# EasyEDA Pro project RCkid.epro, board RCKid
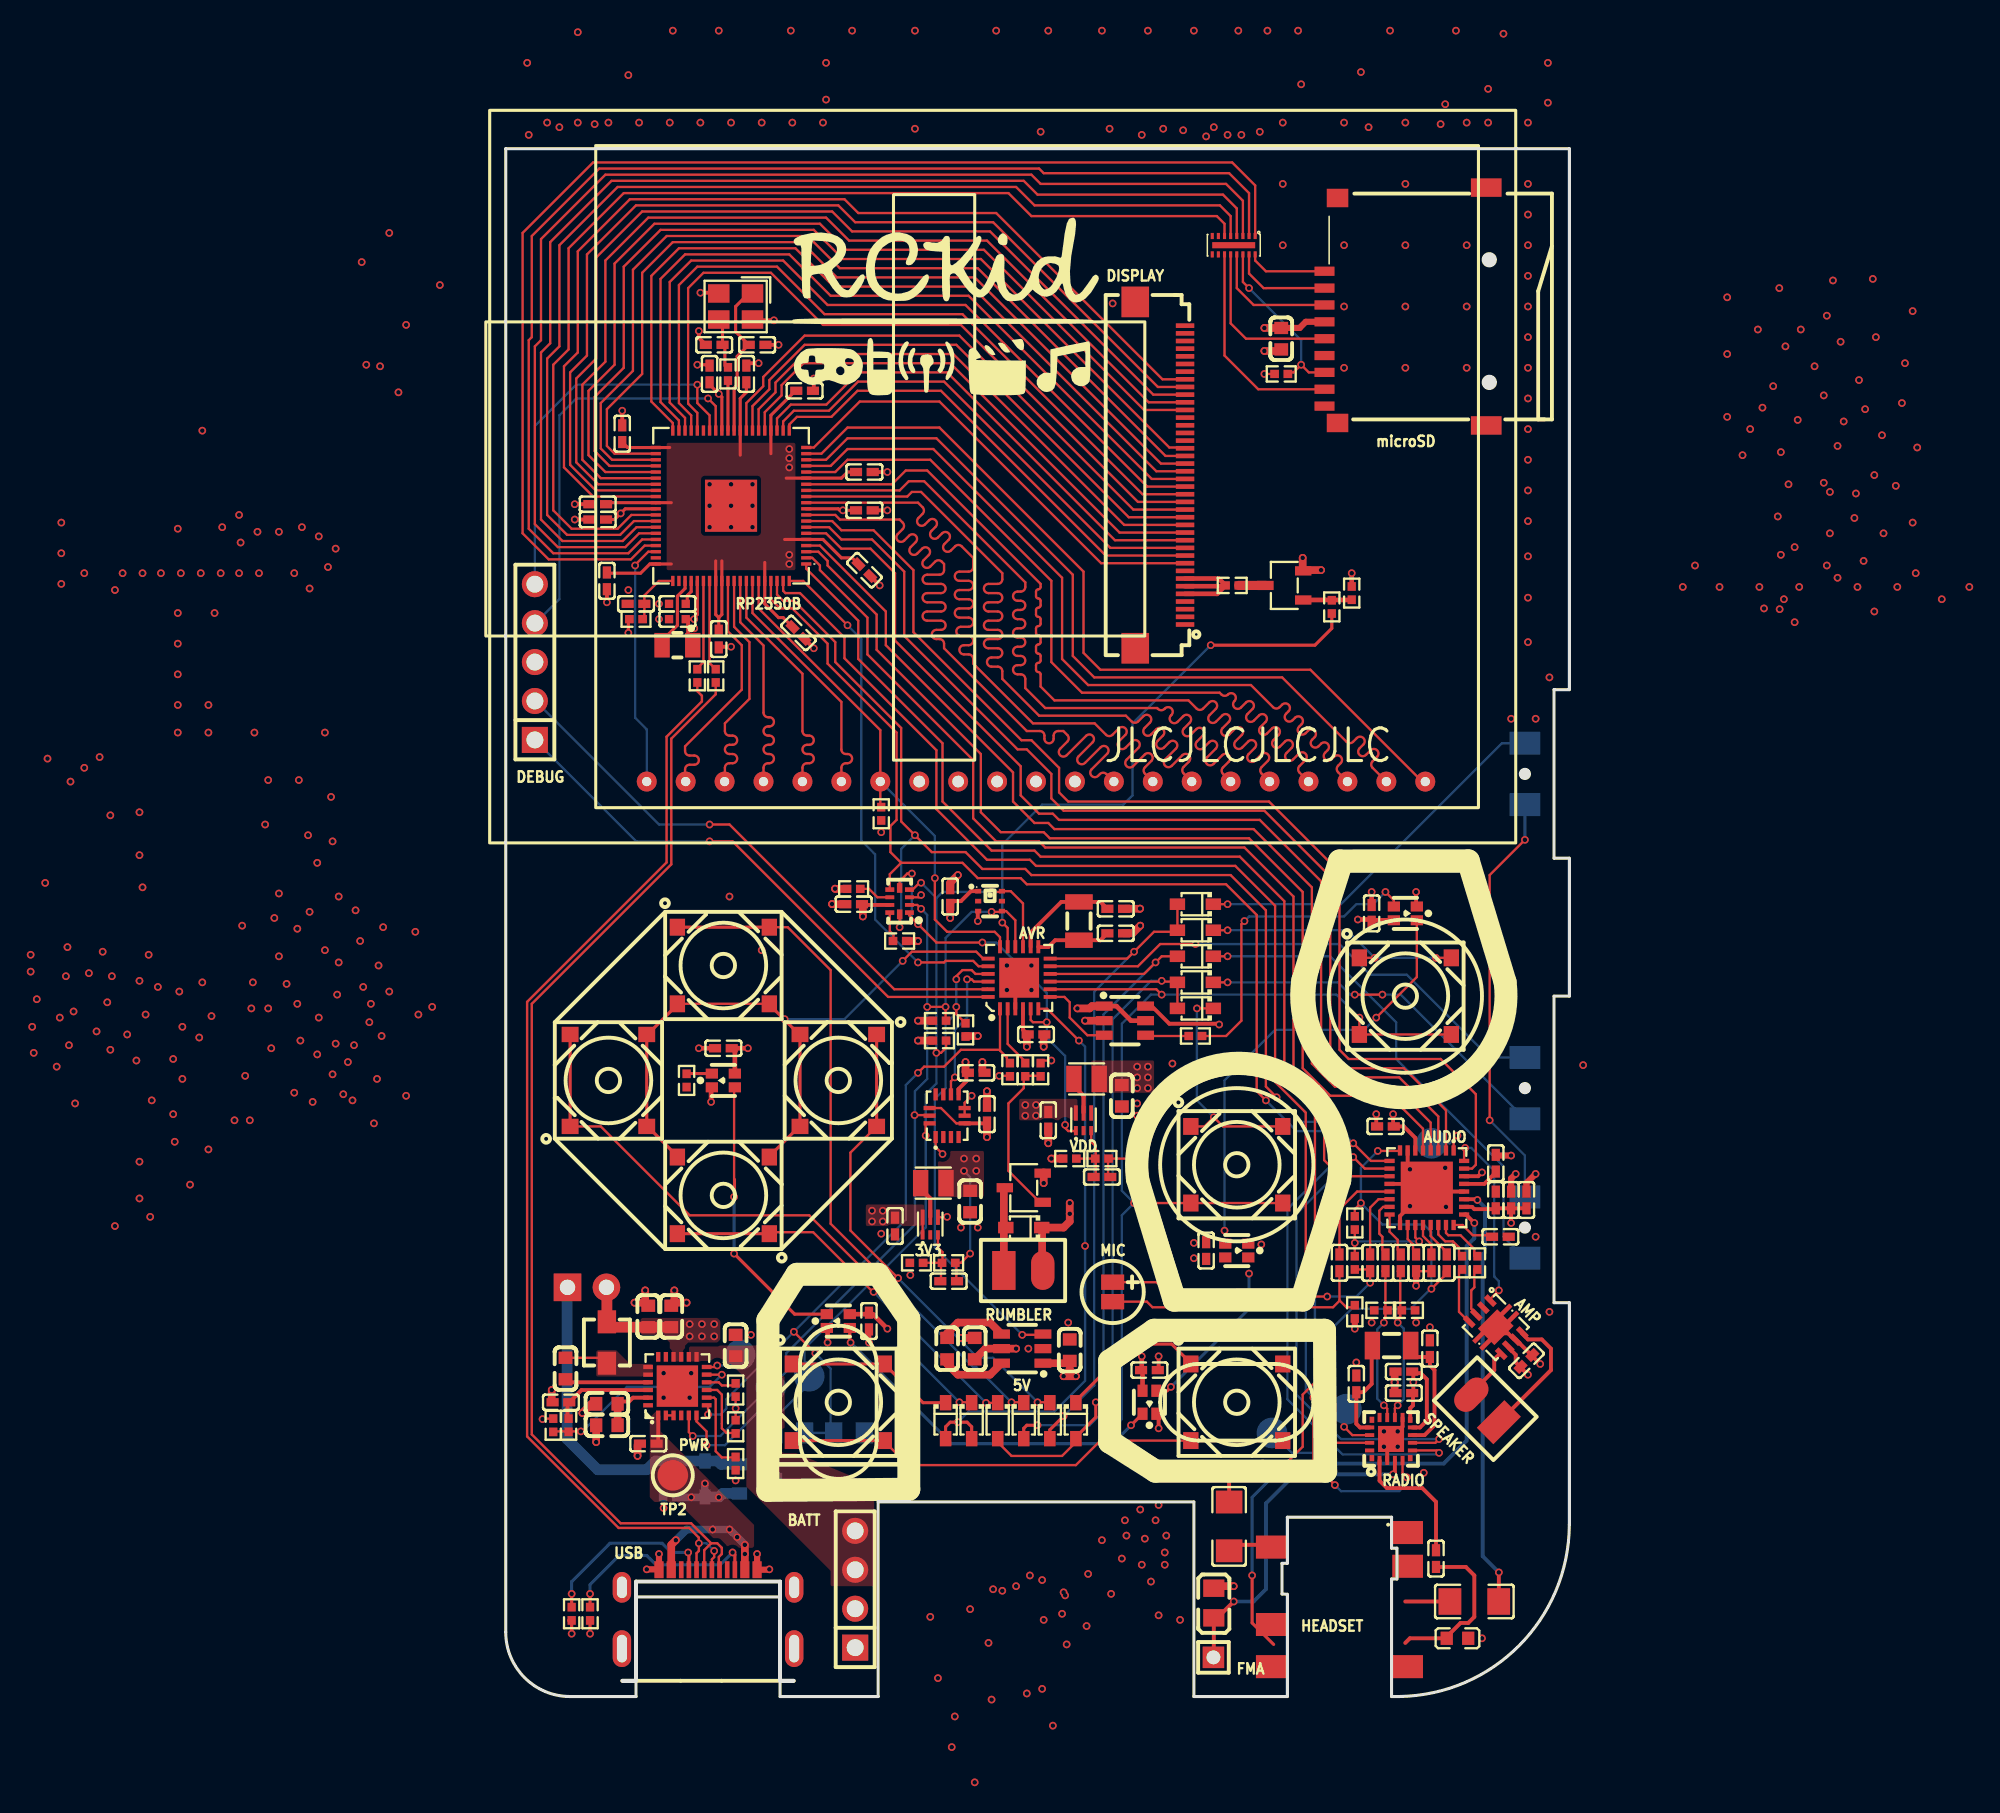
[diagram p26: board, top side]
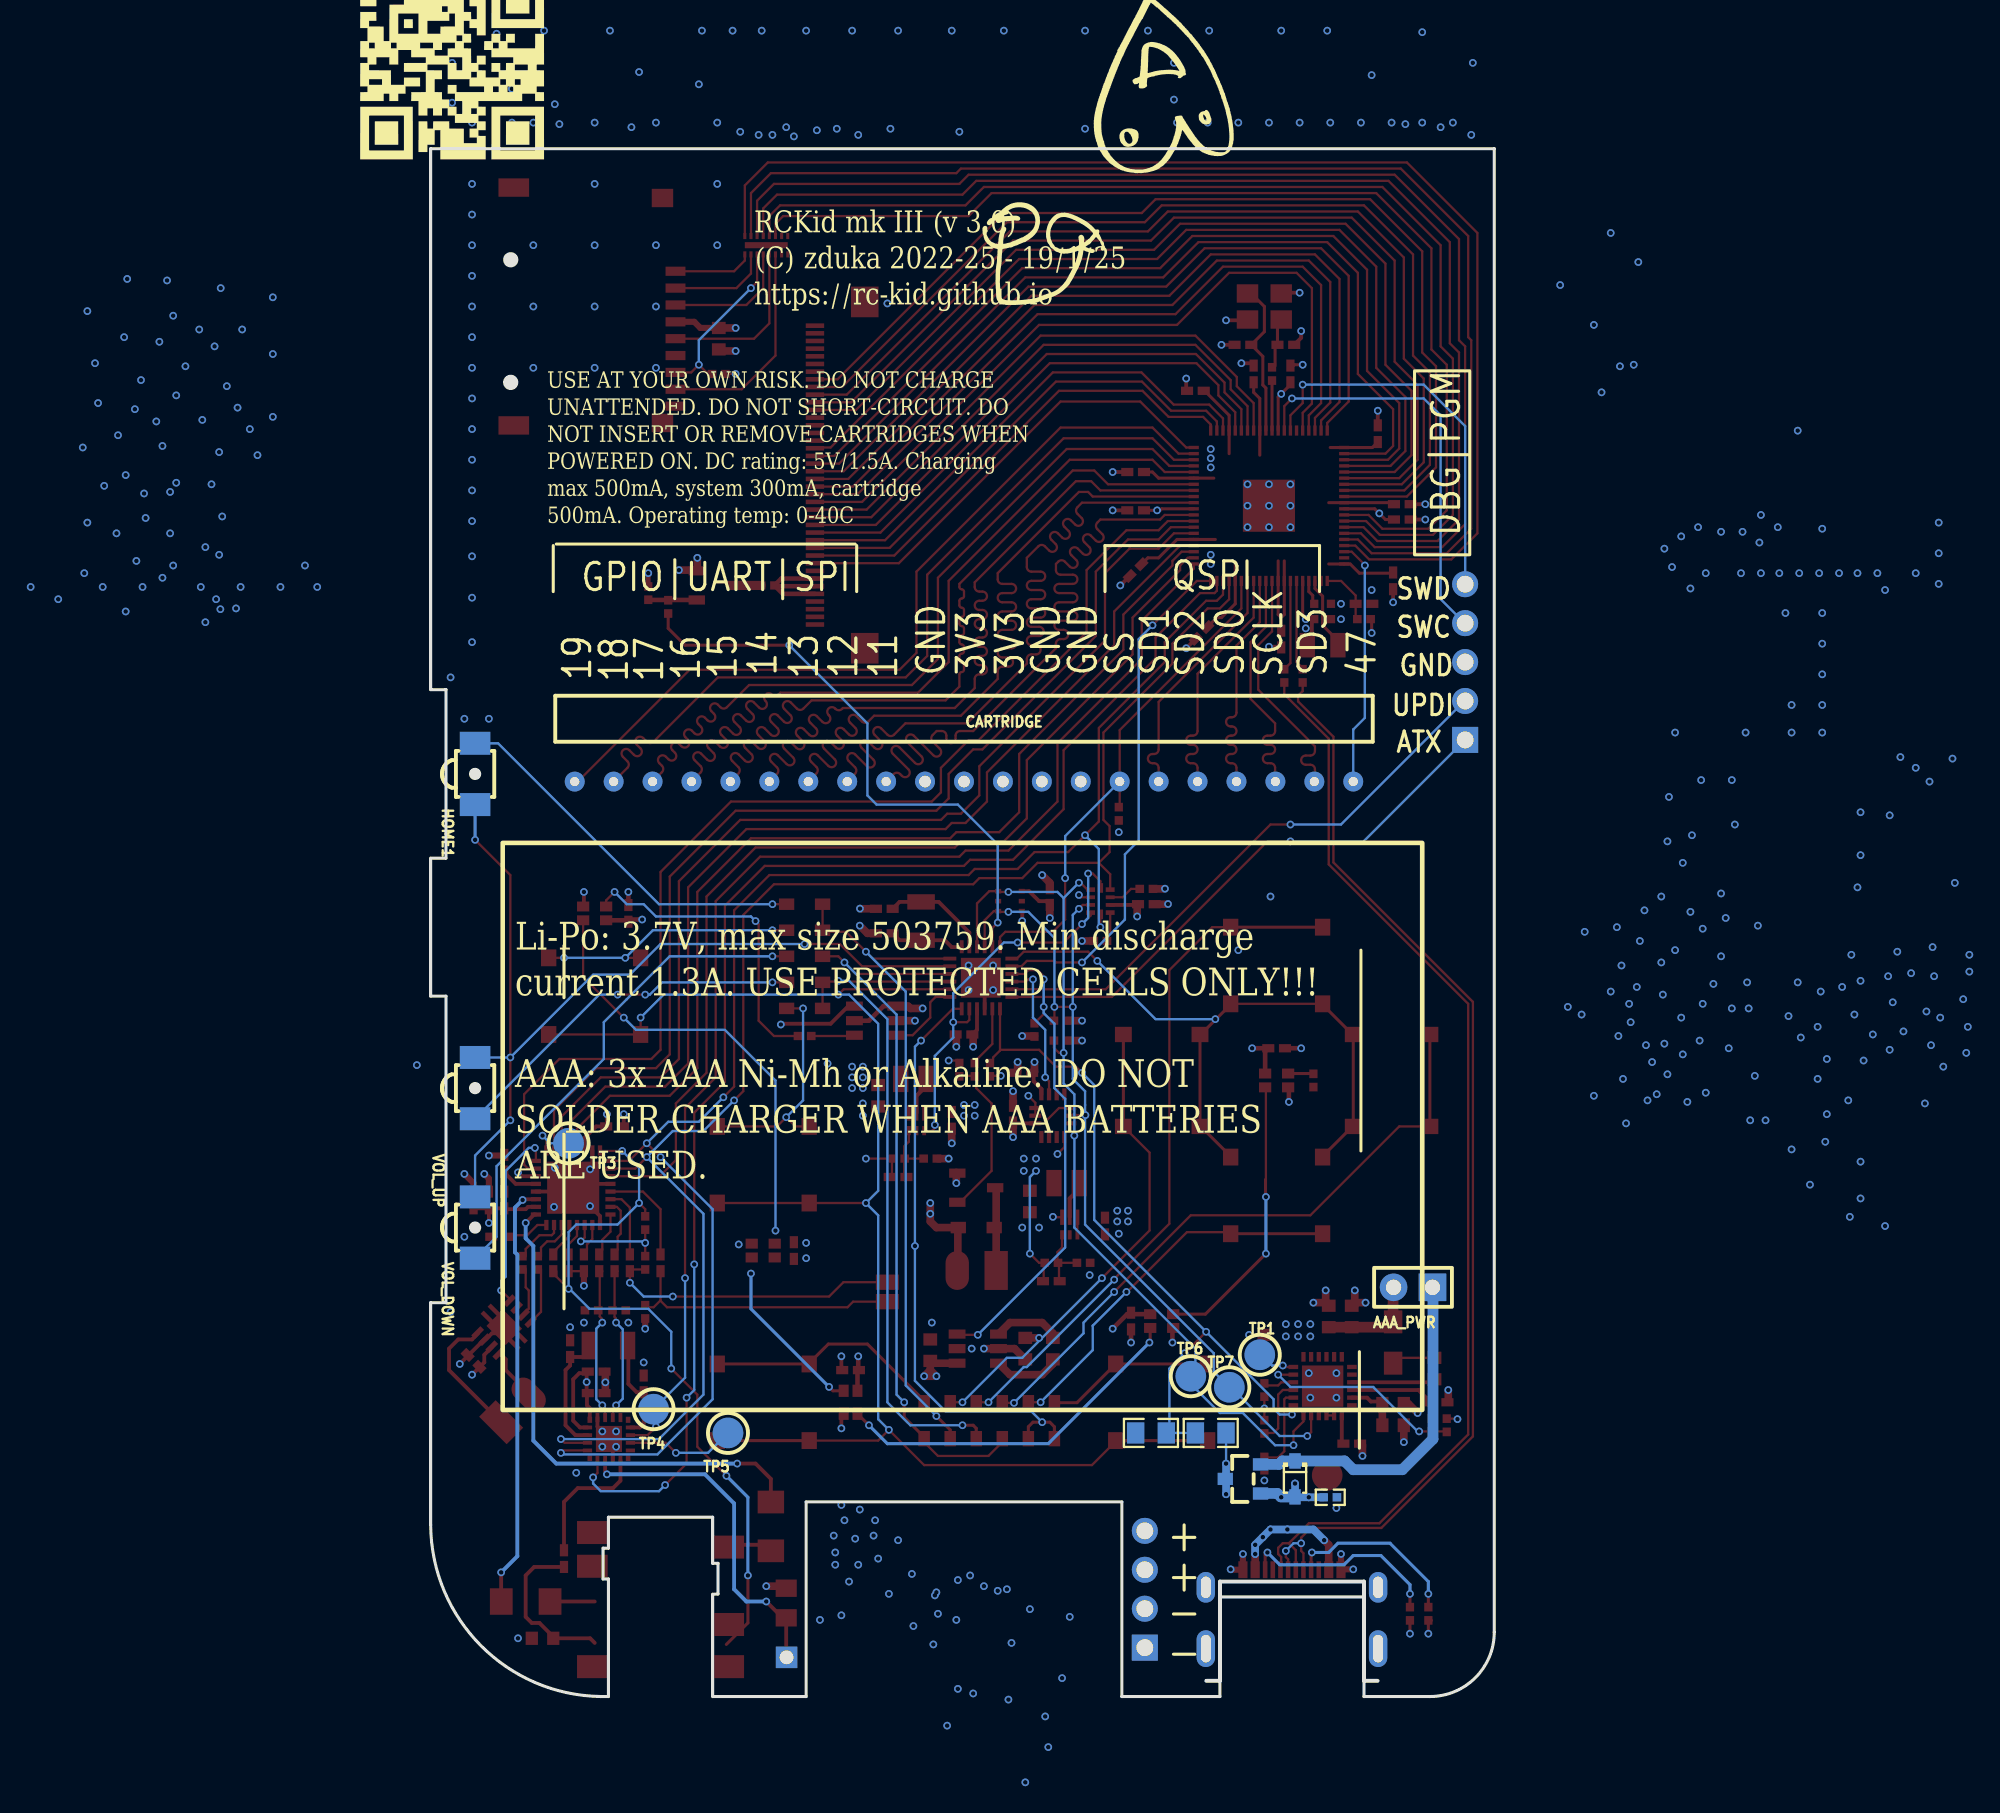
[diagram p27: board, bottom side, seen from below]

Outline 69.4 x 101 mm; copper layers: Top Layer, Inner1, Inner2, Bottom Layer. Coordinates in mm from the lower left corner of the outline.
Outline path: 0,101 69.4,101 69.4,65.7 68.4,65.7 68.4,54.7 69.4,54.7 69.4,45.7 68.4,45.7 68.4,25.7 69.4,25.7 69.4,11.2 arc(66.14,3.34) 58.3,0 57.8,0 57.8,7.67 58.15,7.67 58.15,9.68 57.8,9.68 57.8,11.7 51,11.7 51,8.69 50.65,8.69 50.65,6.69 51,6.67 51,0 44.9,0 44.9,12.7 24.3,12.7 24.3,0 17.9,0 17.9,6.5 8.5,6.5 8.5,0 4.2,0 arc(1.23,1.23) 0,4.2 0,101
Stack: Top Layer 0.035mm / Dielectric1 0.28mm PP er 4.5 / Inner1 0.035mm / Dielectric2 0.28mm FR4 er 4.5 / Inner2 0.035mm / Dielectric3 0.28mm PP er 4.5 / Bottom Layer 0.035mm

## Design rules (mm)
net USB_DM: DP1
net USB_DP: DP1
template: Custom Config
spacing copperThickness1oz (default): track to track 0.45, other pairs 0.127 to 0.3
spacing copperThickness2oz: track to track 0.203, other pairs 0.152 to 0.3
track width copperThickness1oz (default): min 0.127, default 0.254, max 2.54
track width copperThickness2oz: min 0.203, default 0.254, max 2.54
differential pair differentialPair (default): width min 0.127, default 0.254, max 2.54; gap min 0.152, default 0.152
via viaSize (default): diameter min 0.5, default 0.61, max 10; hole min 0.3, default 0.305, max 6.3
net 3V3 uses copperRegion1
net VUSB uses copperRegion1
net 5V uses copperRegion1
net VCC uses copperRegion1
net $1N63472 uses copperRegion1
net VBATT uses copperRegion1
pour e832 uses copperRegion1

## Placement (name value [footprint] x y rotation side)
3V3  TPS62825DMQT  [VSON-6_L1.5-W1.5-P0.50-TL]  27.7 30.7 90 top
5V  HX4002-MFC  [SOT-23-6_L2.9-W1.6-P0.95-LS2.8-BR]  33.7 22.7 0 top
A1  SKRRACE010  [KEY-SMD_4P-L7.5-W7.0-P5.00-TL]  47.7 34.7 0 top
AAA_PWR  -  [HDR-TH_2P-P2.54-V-M-1]  5.3 26.7 0 bottom
AMP  TPA2006D1DRBR  [VSON-8_L3.0-W3.0-P0.65-TL-EP]  64.6 24.1 315 top
AUDIO  TLV320AIC3204IRHBR  [QFN-32_L5.0-W5.0-P0.50-TL-EP3.4]  60.1 33.2 270 top
AVR  ATTINY3217-MFR  [WQFN-24_L4.0-W4.0-P0.50-TL-EP2.6]  33.5 46.9 90 top
B1  SKRRACE010  [KEY-SMD_4P-L7.5-W7.0-P5.00-TL]  58.7 45.7 0 top
B2  SKRRACE010  [KEY-SMD_4P-L7.5-W7.0-P5.00-TL]  47.7 19.2 0 top
B3  SKRRACE010  [KEY-SMD_4P-L7.5-W7.0-P5.00-TL]  21.7 19.2 0 top
BATT  -  [HDR-TH_4P-P2.54-V-M]  22.8 7 90 top
BOTTOM1  SKRRACE010  [KEY-SMD_4P-L7.5-W7.0-P5.00-TL]  21.7 40.2 270 top
C81  10uF  [C0603]  30.6 22.7 270 top
C82  10uF  [C0603]  36.8 22.6 270 top
C83  2.2uF  [C0603]  28.8 22.7 270 top
C95  100nF  [C0402#2]  31.4 38 270 top
C96  100nF  [C0402#2]  30.7 40.7 180 top
C101  100nF  [C0402#2]  45.7 29.1 270 top
C102  100nF  [C0402#2]  56.5 51.1 270 top
C104  100nF  [C0402#2]  14.2 42.3 0 top
C107  100nF  [C0402#2]  23.4 73.5 135 top
C108  100nF  [C0402#2]  19.1 69.4 135 top
C109  100nF  [C0402#2]  19.5 85.2 180 top
C110  100nF  [C0402#2]  6 77.8 0 top
C111  100nF  [C0402#2]  7.6 82.4 270 top
C112  100nF  [C0402#2]  23.4 79.9 180 top
C114  100nF  [C0402#2]  6 76.8 0 top
C115  1uF  [C0402#2]  23.4 77.4 180 top
C116  1uF  [C0402#2]  6.6 72.8 90 top
C117  100nF  [C0402#2]  15.7 86.3 270 top
C118  100nF  [C0402#2]  34.6 43.2 180 top
C132  22uF  [C0603]  50.6 88.6 90 top
C143  100nF  [C0402#2]  23.7 24.5 90 top
C144  100nF  [C0402#2]  42 21.3 180 top
C153  15pF  [C0402#2]  16.4 88.2 0 top
C154  15pF  [C0402#2]  13.6 88.2 180 top
C167  100nF  [C0402#2]  13.9 69 90 top
C191  100nF  [C0402#2]  64.6 32.4 270 top
C192  1uF  [C0402#2]  65.6 32.4 270 top
C199  220uF  [C1206]  47.2 11.1 90 top
C200  220uF  [C1206]  63.2 6.2 0 top
C201  10uF  [C0402#2]  59.4 28.3 270 top
C202  10uF  [C0402#2]  64.9 30 0 top
C203  10uF  [C0402#2]  64.6 34.8 90 top
C204  10uF  [C0402#2]  66.6 32.4 90 top
C205  100nF  [C0402#2]  56.4 28.3 270 top
C206  100nF  [C0402#2]  54.4 28.3 270 top
C207  100nF  [C0402#2]  61.4 28.3 270 top
C208  1uF  [C0402#2]  66.6 21.9 225 top
C209  1uF  [C0402#2]  57.4 37.2 0 top
C210  4.7uF  [C0402#2]  13.3 86.3 270 top
C211  4.7uF  [C0402]  11.2 71.3 0 top
C212  4.7uF  [C0402]  11.2 70.3 0 top
C213  4.7uF  [C0402#2]  8.5 71.3 180 top
C214  4.7uF  [C0402#2]  3.6 19.2 0 top
C215  22uF  [C0603]  6.6 19.1 0 top
C216  22uF  [C0603]  6.6 17.7 0 top
C218  1uF  [C0402#2]  9.3 16.5 0 top
C219  10uF  [C0603]  9.3 24.8 270 top
C220  10uF  [C0603]  10.8 24.8 270 top
C221  10uF  [C0603]  15 22.9 270 top
C224  4.7uF  [C0402#2]  25.4 30.7 90 top
C225  4.7uF  [C0402#2]  35.4 37.6 90 top
C228  22uF  [C0603]  30.3 32.3 90 top
C229  22uF  [C0603]  40.2 39.2 90 top
C230  120pF  [C0402#2]  28.9 27.1 0 top
C231  120pF  [C0402#2]  38.9 33.9 0 top
C232  120pF  [C0402#2]  39.8 49.8 180 top
C233  120pF  [C0402#2]  39.8 51.4 180 top
C234  100nF  [C0402#2]  22.7 51.7 0 top
C235  100nF  [C0402#2]  29 52.2 270 top
C236  22nF  [C0402#2]  58.6 19.8 0 top
C237  100nF  [C0402#2]  58.6 21.2 180 top
C238  120pF  [C0402#2]  60.3 22.7 90 top
C239  120pF  [C0402#2]  55.5 20.4 270 top
C240  100nF  [C0402#2]  57.4 28.3 90 top
C241  100nF  [C0402#2]  58.4 28.3 90 top
C242  100pF  [C0402#2]  60.7 9 90 top
C243  47nF  [C0603]  3.9 21.4 90 top
C244  100nF  [C0402#2]  60.4 28.3 90 top
CARTRIDGE  RCKid2 Cartridge Connector Female  [RCKID2 CARTRIDGE FEMALE]  34.6 59.7 180 bottom
D4  1N5819WS  [SOD-323_L1.8-W1.3-LS2.5-RD]  33.8 30.6 180 top
D5  1N5819WS  [SOD-323_L1.8-W1.3-LS2.5-RD]  35.5 18 270 top
D6  1N5819WS  [SOD-323_L1.8-W1.3-LS2.5-RD]  33.8 18 270 top
D7  1N5819WS  [SOD-323_L1.8-W1.3-LS2.5-RD]  32.1 18 270 top
D8  1N5819WS  [SOD-323_L1.8-W1.3-LS2.5-RD]  30.4 18 270 top
D9  1N5819WS  [SOD-323_L1.8-W1.3-LS2.5-RD]  45 50 180 top
D10  1N5819WS  [SOD-323_L1.8-W1.3-LS2.5-RD]  45 44.9 180 top
D11  1N5819WS  [SOD-323_L1.8-W1.3-LS2.5-RD]  37.2 18 270 top
D12  1N5819WS  [SOD-323_L1.8-W1.3-LS2.5-RD]  28.7 18 270 top
D14  1N5819WS  [SOD-323_L1.8-W1.3-LS2.5-RD]  45 46.6 180 top
D15  1N5819WS  [SOD-323_L1.8-W1.3-LS2.5-RD]  45 48.3 180 top
D16  BAT60JFILM  [SOD-323_L1.8-W1.3-LS2.5-RD]  13 14.2 270 bottom
D17  1N5819WS  [SOD-323_L1.8-W1.3-LS2.5-RD]  45 51.7 180 top
DEBUG  -  [HDR-TH_5P-P2.54-V-M]  1.9 67.5 90 top
DISPLAY  FPC-05FB-40PH20  [FPC-SMD_40P-P0.50_XUNPU_FPC-05FB-40PH20]  42.7 79.7 270 top
FMA  -  [HDR-TH_1P-V-M_XKB_X4611WV-01I-C28D40]  46.18 2.55 0 top
HEADSET  PJ-342D  [AUDIO-SMD_PJ-342D]  54.4 -0.8 90 top
HOME1  B3U-3000PM-B  [key-smd_b3u-3000pm-b]  66.5 60.2 90 bottom
L15  IP4252CZ16-8-TTL,1  [UDFN-16_L3.3-W1.4-P0.40-BL-EP]  47.5 94.7 180 top
L16  AOTA-B201610S3R3-101-T  [IND-SMD_L2.0-W1.6_AOTA-B201610S3R3-101-T]  11.2 68.6 0 top
L17  2.2uH  [IND-SMD_L3.0-W3.0_IHLP-1212BZ]  6.6 23.1 90 top
L18  270nH  [L0603]  62.1 3.8 0 top
L19  120nH  [L0805]  46.2 6.1 90 top
LED7  XL-1615RGBC-WS2812B  [LED-SMD_4P-L1.6-W1.5_XL-1615RGBC-WS2812B]  47.7 29.1 180 top
LED8  XL-1615RGBC-WS2812B  [LED-SMD_4P-L1.6-W1.5_XL-1615RGBC-WS2812B]  58.7 51.1 180 top
LED10  XL-1615RGBC-WS2812B  [LED-SMD_4P-L1.6-W1.5_XL-1615RGBC-WS2812B]  14.2 40.2 0 top
LED11  XL-1615RGBC-WS2812B  [LED-SMD_4P-L1.6-W1.5_XL-1615RGBC-WS2812B]  21.7 24.5 0 top
LED12  XL-1615RGBC-WS2812B  [LED-SMD_4P-L1.6-W1.5_XL-1615RGBC-WS2812B]  42 19.2 90 top
LEFT1  SKRRACE010  [KEY-SMD_4P-L7.5-W7.0-P5.00-TL]  14.2 47.7 0 top
MIC  GMI4015-2C-56db  [MIC-SMD_BD4.0_GMI4015-2C-32DB]  39.6 26.4 270 top
microSD  TF-01A  [TF-SMD_TF-01A]  58.7 90.7 90 top
PWR  -  [QFN-24_L4.0-W4.0-P0.50-TL-EP2.7]  11.2 20.25 90 top
Q6  AO3400A  [SOT-23-3_L2.9-W1.6-P1.90-LS2.8-BR]  50.8 72.5 0 top
Q8  AO3401A  [SOT-23_L2.9-W1.3-P1.90-LS2.4-BR]  16.4 14.2 180 bottom
Q9  AO3400A  [SOT-23-3_L2.9-W1.6-P1.90-LS2.8-BR]  33.8 33.2 0 top
R45  2.2kΩ  [R0402]  28.3 44.1 180 top
R46  2.2kΩ  [R0402]  28.3 42.8 180 top
R48  10kΩ  [R0402]  30 43.5 270 top
R50  22Ω  [R0402]  12.5 66.6 90 top
R51  22Ω  [R0402]  13.7 66.6 90 top
R52  10kΩ  [R0402]  10.7 13 0 bottom
R54  10kΩ  [R0402]  34.9 40.9 90 top
R55  10kΩ  [R0402]  55.2 72 90 top
R56  10kΩ  [R0402]  24.5 57.6 270 top
R57  5.1kΩ  [R0402]  5.5 5.4 270 top
R58  5.1kΩ  [R0402]  4.3 5.4 270 top
R76  10kΩ  [R0402]  50.6 86.3 0 top
R84  5.11Ω  [R0402]  47.4 72.5 0 top
R87  470Ω  [R0402]  45 43.1 0 top
R88  470Ω  [R0402]  11.8 40.2 270 top
R91  1kΩ  [R0402]  33.9 40.9 90 top
R92  1kΩ  [R0402]  53.9 71.1 270 top
R93  1kΩ  [R0402]  14.5 86.3 90 top
R103  1kΩ  [R0402]  55.4 28.3 90 top
R104  1kΩ  [R0402]  55.4 25.1 90 top
R105  220kΩ  [R0402]  62.4 28.3 270 top
R106  220kΩ  [R0402]  63.4 28.3 270 top
R109  33Ω  [R0402]  8.5 70.3 0 top
R110  10kΩ  [R0402]  15 17.6 90 top
R111  10kΩ  [R0402]  15 15.2 270 top
R112  10kΩ  [R0402]  4.1 17.7 270 top
R113  10kΩ  [R0402]  3.1 17.7 90 top
R115  100kΩ  [R0402]  26.8 28.3 0 top
R116  100kΩ  [R0402]  36.8 35.1 0 top
R117  450kΩ  [R0402]  28.9 28.3 0 top
R118  450kΩ  [R0402]  38.9 35.1 0 top
R119  10kΩ  [R0402]  25.7 49.3 0 top
R120  10kΩ  [R0402]  22.7 52.7 180 top
R121  10kΩ  [R0402]  58.9 25.2 0 top
R122  10kΩ  [R0402]  57.1 25.2 180 top
R123  2.7kΩ  [R0402]  55.4 30.9 270 top
R124  10kΩ  [R0402]  32.9 40.9 270 top
R125  24kΩ  [R0402]  15 20 270 top
R126  300kΩ  [R0805]  18.5 17.2 180 bottom
R127  570k  [R0805]  22.4 17.2 180 bottom
RADIO  SI4705-D60-GMR  [QFN-20_L3.0-W3.0-P0.50-TL-EP1.7_SILICON-LABS_SI4X55]  57.77 16.81 90 top
RIGHT1  SKRRACE010  [KEY-SMD_4P-L7.5-W7.0-P5.00-TL]  14.2 32.7 180 top
RP2350B  RP2350B  [QFN-80_L10.0-W10.0-P0.40-TL-EP3.4]  14.7 77.7 180 top
RUMBLER  -  [SMT wire pad (2)]  32.5 27.8 90 top
SPEAKER  -  [SMT wire pad (2)]  64.8 17.9 225 top
TOP1  SKRRACE010  [KEY-SMD_4P-L7.5-W7.0-P5.00-TL]  6.7 40.2 90 top
TP1  -  [TESTPOINT-SMD_BD1.5_P70-5000045R]  15.3 22.3 180 bottom
TP2  -  [TESTPOINT-SMD_BD1.5_P70-5000045R]  10.9 14.43 0 top
TP3  -  [TESTPOINT-SMD_BD1.5_P70-5000045R]  60.4 36.1 180 bottom
TP4  -  [TESTPOINT-SMD_BD1.5_P70-5000045R]  54.85 18.75 180 bottom
TP5  -  [TESTPOINT-SMD_BD1.5_P70-5000045R]  50 17.2 180 bottom
TP6  -  [TESTPOINT-SMD_BD1.5_P70-5000045R]  19.8 20.9 180 bottom
TP7  -  [TESTPOINT-SMD_BD1.5_P70-5000045R]  17.28 20.18 180 bottom
U26  BMI160  [LGA-14_L3.0-W2.5-P0.50-BL]  28.8 37.9 0 top
U33  SN74LVC1T45DBVR  [SOT-23-6_L2.9-W1.6-P0.95-LS2.8-BR]  40.4 44.1 180 top
U39  ABM8-272-T3  [CRYSTAL-SMD_4P-L3.2-W2.5-BL]  15 90.7 180 top
U40  TS5A23159RSER  [UQFN-10_L2.0-W1.5-P0.50-BL-EP]  25.7 51.9 90 top
U41  LTR-390UV-01  [SENSOR-SMD_LTR-390UV-01]  31.6 51.9 270 top
USB  TYPE-C-F02C-1BBWC1.6  [USB-C-SMD_TYPE-C-F02C-1BBWC1.6]  13.2 5.7 0 top
USB1  470nH  [IND-SMD_L2.0-W1.6]  27.9 33.5 180 top
USB2  470nH  [IND-SMD_L2.0-W1.6]  37.9 40.3 180 top
VDD  TPS62825DMQT  [VSON-6_L1.5-W1.5-P0.50-TL]  37.7 37.5 90 top
VOL_DOWN  B3U-3000PM-B  [key-smd_b3u-3000pm-b]  66.5 30.6 90 bottom
VOL_UP  B3U-3000PM-B  [key-smd_b3u-3000pm-b]  66.5 39.7 90 bottom
X1  32.768kHz  [FC-135R_L3.2-W1.5]  37.4 50.6 90 top
X2  32.768kHz  [FC-135R_L3.2-W1.5]  57.8 22.9 180 top

## Footprints (pads in the part's own frame, mm; a bottom-side part is the same pattern mirrored in y, then rotated)
AUDIO-SMD_PJ-342D
  rect 1.5x2 smd: 1(2.75,-4.45) 2(2.75,4.45) 3(9.3,-4.45) 4(5.5,4.45) 5(10.55,4.45) 6(11.5,-4.45)
C0402
  rect 0.54x0.54 smd: 1(-0.545,0) 2(0.545,0)
C0402#2
  rect 0.79x0.54 smd: 1(-0.545,0) 2(0.545,0)
C0603
  rect 0.8x0.9 smd: 1(-0.7,0) 2(0.7,0)
C1206
  rect 1.485x1.728 smd: 1(-1.593,0) 2(1.593,0)
CRYSTAL-SMD_4P-L3.2-W2.5-BL
  rect 1.4x1.2 smd: 1(-1.1,-0.85) 2(1.1,-0.85) 3(1.1,0.85) 4(-1.1,0.85)
FC-135R_L3.2-W1.5
  rect 1x1.8 smd: 1(-1.25,0) 2(1.25,0)
FPC-SMD_40P-P0.50_XUNPU_FPC-05FB-40PH20
  rect 0.3x1.2 smd: 1(9.75,1.625) 2(9.25,1.625) 3(8.75,1.625) 4(8.25,1.625) 5(7.75,1.625) 6(7.25,1.625) 7(6.75,1.625) 8(6.25,1.625) 9(5.75,1.625) 10(5.25,1.625) 11(4.75,1.625) 12(4.25,1.625) 13(3.75,1.625) 14(3.25,1.625) 15(2.75,1.625) 16(2.25,1.625) 17(1.75,1.625) 18(1.25,1.625) 19(0.75,1.625) 20(0.25,1.625) 21(-0.25,1.625) 22(-0.75,1.625) 23(-1.25,1.625) 24(-1.75,1.625) 25(-2.25,1.625) 26(-2.75,1.625) 27(-3.25,1.625) 28(-3.75,1.625) 29(-4.25,1.625) 30(-4.75,1.625) 31(-5.25,1.625) 32(-5.75,1.625) 33(-6.25,1.625) 34(-6.75,1.625) 35(-7.25,1.625) 36(-7.75,1.625) 37(-8.25,1.625) 38(-8.75,1.625) 39(-9.25,1.625) 40(-9.75,1.625)
  rect 2x1.8 smd: 41(-11.3,-1.625) 42(11.3,-1.625)
HDR-TH_1P-V-M_XKB_X4611WV-01I-C28D40
  rect 1.4x1.4 hole 0.9: 1(0,0)
HDR-TH_2P-P2.54-V-M-1
  rect 1.8x1.8 hole 1: 1(-1.27,0)
  round 1.8 hole 1: 2(1.27,0)
HDR-TH_4P-P2.54-V-M
  rect 1.7x1.7 hole 1.1: 1(-3.81,0)
  round 1.7 hole 1.1: 2(-1.27,0) 3(1.27,0) 4(3.81,0)
HDR-TH_5P-P2.54-V-M
  rect 1.7x1.7 hole 1.1: 1(-5.08,0)
  round 1.7 hole 1.1: 2(-2.54,0) 3(0,0) 4(2.54,0) 5(5.08,0)
IND-SMD_L2.0-W1.6
  rect 1x1.72 smd: 1(0.828,0) 2(-0.828,0)
IND-SMD_L2.0-W1.6_AOTA-B201610S3R3-101-T
  rect 1x1.6 smd: 1(-1,0) 2(1,0)
IND-SMD_L3.0-W3.0_IHLP-1212BZ
  rect 1.5x1.2 smd: 1(-1.35,0) 2(1.35,0)
KEY-SMD_4P-L7.5-W7.0-P5.00-TL
  rect 1x1.1 smd: 1(-3,2.5) 2(-3,-2.5) 3(3,2.5) 4(3,-2.5)
key-smd_b3u-3000pm-b
  rect 1.5x2 smd: 1(-2,0) 2(2,0)
L0603
  rect 0.8x0.864 smd: 1(-0.7,0) 2(0.7,0)
L0805
  rect 1.133x1.377 smd: 1(-0.966,0) 2(0.966,0)
LED-SMD_4P-L1.6-W1.5_XL-1615RGBC-WS2812B
  rect 0.8x0.65 smd: 1(-0.75,0.45) 2(0.75,0.45) 3(-0.75,-0.45) 4(0.75,-0.45)
LGA-14_L3.0-W2.5-P0.50-BL
  rect 0.28x0.785 smd: 1(-0.75,-1.393) 2(-0.25,-1.393) 3(0.25,-1.393) 4(0.75,-1.393) 8(0.75,1.393) 9(0.25,1.393) 10(-0.25,1.393) 11(-0.75,1.393)
  rect 0.785x0.28 smd: 5(1.143,-0.5) 6(1.143,0) 7(1.143,0.5) 12(-1.143,0.5) 13(-1.143,0) 14(-1.143,-0.5)
MIC-SMD_BD4.0_GMI4015-2C-32DB
  rect 1x1.5 smd: 1(-0.635,0) 2(0.635,0)
QFN-20_L3.0-W3.0-P0.50-TL-EP1.7_SILICON-LABS_SI4X55
  rect 0.4x0.3 smd: 1(-1.25,1.25) 6(-1.25,-1.25) 11(1.25,-1.25) 16(1.25,1.25)
  rect 0.6x0.25 smd: 2(-1.4,0.75) 3(-1.4,0.25) 4(-1.4,-0.25) 5(-1.4,-0.75) 12(1.4,-0.75) 13(1.4,-0.25) 14(1.4,0.25) 15(1.4,0.75)
  rect 0.25x0.6 smd: 7(-0.75,-1.4) 8(-0.25,-1.4) 9(0.25,-1.4) 10(0.75,-1.4) 17(0.75,1.4) 18(0.25,1.4) 19(-0.25,1.4) 20(-0.75,1.4)
  rect 1.7x1.7 smd: 21(0,0)
QFN-24_L4.0-W4.0-P0.50-TL-EP2.7
  rect 0.633x0.28 smd: 1(-1.911,1.25) 2(-1.911,0.75) 3(-1.911,0.25) 4(-1.911,-0.25) 5(-1.911,-0.75) 6(-1.911,-1.25) 13(1.911,-1.25) 14(1.911,-0.75) 15(1.911,-0.25) 16(1.911,0.25) 17(1.911,0.75) 18(1.911,1.25)
  rect 0.28x0.633 smd: 7(-1.25,-1.911) 8(-0.75,-1.911) 9(-0.25,-1.911) 10(0.25,-1.911) 11(0.75,-1.911) 12(1.25,-1.911) 19(1.25,1.911) 20(0.75,1.911) 21(0.25,1.911) 22(-0.25,1.911) 23(-0.75,1.911) 24(-1.25,1.911)
  rect 2.7x2.7 smd: 25(0,0)
QFN-32_L5.0-W5.0-P0.50-TL-EP3.4
  rect 0.665x0.28 smd: 1(-2.433,1.75) 2(-2.433,1.25) 3(-2.433,0.75) 4(-2.433,0.25) 5(-2.433,-0.25) 6(-2.433,-0.75) 7(-2.433,-1.25) 8(-2.433,-1.75) 17(2.433,-1.75) 18(2.433,-1.25) 19(2.433,-0.75) 20(2.433,-0.25) 21(2.433,0.25) 22(2.433,0.75) 23(2.433,1.25) 24(2.433,1.75)
  rect 0.28x0.665 smd: 9(-1.75,-2.433) 10(-1.25,-2.433) 11(-0.75,-2.433) 12(-0.25,-2.433) 13(0.25,-2.433) 14(0.75,-2.433) 15(1.25,-2.433) 16(1.75,-2.433) 25(1.75,2.433) 26(1.25,2.433) 27(0.75,2.433) 28(0.25,2.433) 29(-0.25,2.433) 30(-0.75,2.433) 31(-1.25,2.433) 32(-1.75,2.433)
  rect 3.4x3.4 smd: 33(0,0)
QFN-80_L10.0-W10.0-P0.40-TL-EP3.4
  rect 0.665x0.22 smd: 1(-4.907,3.8) 2(-4.907,3.4) 3(-4.907,3) 4(-4.907,2.6) 5(-4.907,2.2) 6(-4.907,1.8) 7(-4.907,1.4) 8(-4.907,1) 9(-4.907,0.6) 10(-4.907,0.2) 11(-4.907,-0.2) 12(-4.907,-0.6) 13(-4.907,-1) 14(-4.907,-1.4) 15(-4.907,-1.8) 16(-4.907,-2.2) 17(-4.907,-2.6) 18(-4.907,-3) 19(-4.907,-3.4) 20(-4.907,-3.8) 41(4.907,-3.8) 42(4.907,-3.4) 43(4.907,-3) 44(4.907,-2.6) 45(4.907,-2.2) 46(4.907,-1.8) 47(4.907,-1.4) 48(4.907,-1) 49(4.907,-0.6) 50(4.907,-0.2) 51(4.907,0.2) 52(4.907,0.6) 53(4.907,1) 54(4.907,1.4) 55(4.907,1.8) 56(4.907,2.2) 57(4.907,2.6) 58(4.907,3) 59(4.907,3.4) 60(4.907,3.8)
  rect 0.22x0.665 smd: 21(-3.8,-4.907) 22(-3.4,-4.907) 23(-3,-4.907) 24(-2.6,-4.907) 25(-2.2,-4.907) 26(-1.8,-4.907) 27(-1.4,-4.907) 28(-1,-4.907) 29(-0.6,-4.907) 30(-0.2,-4.907) 31(0.2,-4.907) 32(0.6,-4.907) 33(1,-4.907) 34(1.4,-4.907) 35(1.8,-4.907) 36(2.2,-4.907) 37(2.6,-4.907) 38(3,-4.907) 39(3.4,-4.907) 40(3.8,-4.907) 61(3.8,4.907) 62(3.4,4.907) 63(3,4.907) 64(2.6,4.907) 65(2.2,4.907) 66(1.8,4.907) 67(1.4,4.907) 68(1,4.907) 69(0.6,4.907) 70(0.2,4.907) 71(-0.2,4.907) 72(-0.6,4.907) 73(-1,4.907) 74(-1.4,4.907) 75(-1.8,4.907) 76(-2.2,4.907) 77(-2.6,4.907) 78(-3,4.907) 79(-3.4,4.907) 80(-3.8,4.907)
  rect 3.4x3.4 smd: 81(0,0)
R0402
  rect 0.566x0.54 smd: 1(-0.433,0) 2(0.433,0)
R0805
  rect 1.133x1.377 smd: 1(-1,0) 2(1,0)
RCKID2 CARTRIDGE FEMALE
  round 1.3 hole 0.6: 1(-25.4,0) 2(-22.86,0) 3(-20.32,0.003) 4(-17.78,0.003) 5(-15.24,0.003) 6(-12.7,0.003) 7(-10.16,0.003) 8(-7.62,0.003) 9(-5.08,0.003) 15(10.16,0.003) 16(12.7,0.003) 17(15.24,0.003) 18(17.78,0.003) 19(20.32,0.003) 20(22.86,0.003) 21(25.4,0.003)
  round 1.3 hole 0.762x0.6: 10(-2.54,0.003) 11(0,0.003) 12(2.54,0.003) 13(5.08,0.003) 14(7.62,0.003)
SENSOR-SMD_LTR-390UV-01
  rect 0.3x0.4 smd: 1(-0.65,-0.775) 2(0,-0.775) 3(0.65,-0.775) 4(0.65,0.775) 5(0,0.775) 6(-0.65,0.775)
SMT wire pad (2)
  rect 2.54x1.524 smd: 1(0,0)
  rrect 2.54x1.524 smd: 2(0,-2.54)
SOD-323_L1.8-W1.3-LS2.5-RD
  rect 1x0.75 smd: 1(-1.173,0) 2(1.173,0)
SOT-23-3_L2.9-W1.6-P1.90-LS2.8-BR
  rect 1.07x0.6 smd: 1(1.235,-0.95) 2(1.235,0.95) 3(-1.235,0)
SOT-23-6_L2.9-W1.6-P0.95-LS2.8-BR
  rect 1.1x0.6 smd: 1(1.35,-0.95) 2(1.35,0) 3(1.35,0.95) 4(-1.35,0.95) 5(-1.35,0) 6(-1.35,-0.95)
SOT-23_L2.9-W1.3-P1.90-LS2.4-BR
  rect 1x0.8 smd: 1(1.15,-0.95) 2(1.15,0.95) 3(-1.15,0)
TESTPOINT-SMD_BD1.5_P70-5000045R
  round 2 smd: 1(0,0)
TF-SMD_TF-01A
  rect 0.6x1.3 smd: 1(2.3,5.276) 2(1.2,5.276) 3(0.101,5.276) 4(-1,5.276) 5(-2.099,5.276) 6(-3.2,5.276) 7(-4.3,5.276) 8(-5.399,5.276) 9(-6.5,5.276)
  rect 1.2x1.4 smd: 10(-7.599,4.426) 13(7.08,4.426)
  rect 1.2x2 smd: 11(-7.76,-5.276) 12(7.76,-5.276)
UDFN-16_L3.3-W1.4-P0.40-BL-EP
  rect 0.2x0.4 smd: 1(-1.4,-0.6) 2(-1,-0.6) 3(-0.6,-0.6) 4(-0.2,-0.6) 5(0.2,-0.6) 6(0.6,-0.6) 7(1,-0.6) 8(1.4,-0.6) 9(1.4,0.6) 10(1,0.6) 11(0.6,0.6) 12(0.2,0.6) 13(-0.2,0.6) 14(-0.6,0.6) 15(-1,0.6) 16(-1.4,0.6)
  rect 2.8x0.4 smd: 17(0,0)
UQFN-10_L2.0-W1.5-P0.50-BL-EP
  rect 0.3x0.58 smd: 1(-0.748,-0.64) 4(0.752,-0.64) 6(0.752,0.64) 9(-0.748,0.64)
  rect 0.25x0.58 smd: 2(-0.248,-0.64) 3(0.252,-0.64) 7(0.252,0.64) 8(-0.248,0.64)
  rect 0.63x0.35 smd: 5(0.86,0) 10(-0.86,-0.002)
USB-C-SMD_TYPE-C-F02C-1BBWC1.6
  oval 1.2x2 hole 0.65x1.4: 13(5.62,1.425) 16(-5.62,1.425)
  oval 1.2x2.4 hole 0.65x1.8: 14(5.62,-2.575) 15(-5.62,-2.575)
  rect 0.3x1.1 smd: A5(-1.25,2.575) A6(-0.25,2.575) A7(0.25,2.575) A8(1.25,2.575) B5(1.75,2.575) B6(0.75,2.575) B7(-0.75,2.575) B8(-1.75,2.575)
  rect 0.6x1.1 smd: A9B4(2.4,2.575) A12B1(3.2,2.575) B9A4(-2.4,2.575) B12A1(-3.2,2.575)
VSON-6_L1.5-W1.5-P0.50-TL
  rect 0.6x0.25 smd: 1(-0.575,0.5) 2(-0.575,0) 3(-0.575,-0.5)
  rect 1x0.25 smd: 4(0.575,-0.5) 5(0.575,0) 6(0.575,0.5)
VSON-8_L3.0-W3.0-P0.65-TL-EP
  rect 0.85x0.34 smd: 1(-1.476,0.975) 2(-1.476,0.325) 3(-1.476,-0.325) 4(-1.476,-0.976) 5(1.476,-0.976) 6(1.476,-0.325) 7(1.476,0.325) 8(1.476,0.976)
  custom 1.52x3.42 smd: 9(0,-0.005)
WQFN-24_L4.0-W4.0-P0.50-TL-EP2.6
  rect 0.85x0.25 smd: 1(-2.025,1.25) 2(-2.025,0.75) 3(-2.025,0.25) 4(-2.025,-0.25) 5(-2.025,-0.75) 6(-2.025,-1.25) 13(2.025,-1.25) 14(2.025,-0.75) 15(2.025,-0.25) 16(2.025,0.25) 17(2.025,0.75) 18(2.025,1.25)
  rect 0.25x0.85 smd: 7(-1.25,-2.025) 8(-0.75,-2.025) 9(-0.25,-2.025) 10(0.25,-2.025) 11(0.75,-2.025) 12(1.25,-2.025) 19(1.25,2.025) 20(0.75,2.025) 21(0.25,2.025) 22(-0.25,2.025) 23(-0.75,2.025) 24(-1.25,2.025)
  rect 2.6x2.6 smd: 25(0.001,0)

## Nets
As in the schematic.

Pads without a net: 3V3 2; AMP 2; AUDIO 33; DISPLAY 1 2 3 4 8 25 26 27 28 34 35 36 37 38 39 40 41 42; HEADSET 5 6; L15 7 8 9 10; microSD 9 12 13; PWR 4 24; R88 2; RADIO 1 15 16 20 21; RP2350B 35 59; U26 4 10 11; U41 2 5; USB 13 14 15 16 A8 B8; VDD 2

## Via types
v1: diameter 0.5, hole 0.3, Top Layer to Bottom Layer, 668 vias

## Routing (per net, layer and track width the routed paths; a pad name or vN(x,y) marks a point on that pad's centre or on a via; arc(x,y) is an arc through that point)
3V3: length 31.2
  Top Layer w0.15: v1(30.3,28.9) 29.7,28.3 29.4,28.3 29.4,27.1 ; v1(32.2,40.5) 32.87,40.5 R124.2 ; U26.12 28.4,38.4 29.4,37.4 U26.5
  Top Layer w0.25: U26.5 31.35,37.4 C95.2 ; U26.8 29.55,39.65 30.05,40.15 30.05,40.7 ; AVR.4 33.75,43.5 C118.2 ; U40.8 23.29,51.65 ; U41.1 30.35,52.55 29.7,51.9 29.24,51.9 C235.2
  Top Layer w0.3: U33.5 40.8,44.1 39.85,45.05 U33.1
  Top Layer w0.5: R46.2 v1(26.9,42.8) ; v1(34,42.4) 34,43.14 C118.2 ; U33.1 38.25,45.05 38.1,44.9 v1(37.3,44.9) ; C234.2 23.3,51.64 v1(23.3,50.9) ; v1(30,41.4) 30,40.75 30.05,40.7 ; R45.2 v1(26.9,44.1) ; C95.2 v1(31.4,36.5) ; C235.2 v1(29,50.8)
  Bottom Layer w0.15: v1(29.9,34.3) 30.3,33.9 v1(30.3,28.9)
  vias: v1(29.9,35.1) v1(30.7,35.1) v1(30.7,34.3)
5V: length 20.1
  Top Layer w0.25: U33.6 42.15,45.05 43.3,43.9 46.5,43.9 v1(46.55,43.85)
  Top Layer w0.3: LED8.2 56.6,50.65 C102.2 56.36,50.7 v1(55.6,50.7) ; LED10.2 14.95,42.09 C104.2 v1(15.8,42.3) ; v1(24.9,24) 23.95,24.94 23.8,24.94 C143.2 23.61,24.95 LED11.2 ; LED12.2 41.55,21.2 C144.2 41.5,21.34 v1(41.5,22.2)
  Top Layer w0.5: 36.8,21.3 v1(36.4,20.9) v1(37.2,20.9) 36.8,21.3 ; 36.8,21.3 C82.2 36.65,21.75 5V.1
  vias: v1(44.9,28.6)
5V_ON: length 31.4
  Top Layer w0.15: v1(29.4,45) 29.4,44.53 R48.1 ; 5V.3 35,23.6 v1(33.7,23.6) ; v1(29.4,46.8) 29.4,47 29.8,47.4 30.4,47.4 30.65,47.15 AVR.21
  Bottom Layer w0.15: v1(33.7,23.6) 28,29.3 28,39 28.7,39.7 28.7,43.9 29.4,44.6 v1(29.4,45) v1(29.4,46.8)
DVDD: length 15
  Top Layer w0.2: C115.2 v1(22,77.4) 21.8,77.4 21.7,77.5 RP2350B.10 ; C114.2 7.1,76.8 v1(7.5,77.2) 7.8,77.5 RP2350B.51 ; 13.3,85.75 13.3,85.6 v1(13.9,85) 14.1,84.8 RP2350B.32 ; 11.9,70.3 12.2,70.3 12.5,70.6 RP2350B.65
  Top Layer w0.25: 11.9,70.3 11.9,68.9 L16.2
  vias: v1(12.3,70.3) v1(12.3,69.7)
GND: length 85.9
  Top Layer w0.15: R113.2 2.43,18.13 v1(2.4,18.1) ; v1(35.6,41.5) 35.03,41.5 35,41.53 ; U26.6 U26.7 29.94,38.74 v1(30.4,39.2) ; 15,19.5 v1(15,18.8) 15,18 ; 3V3.4 28.77,31.27 v1(28.8,31.3) ; U40.3 26.95,52.15 v1(27.1,52.3) ; v1(28.5,35.4) 28.05,35.85 U26.1 ; 60.4,27.75 59.4,27.75
  Top Layer w0.2: 13.1,86.84 13.05,86.9 v1(12.5,86.9) ; v1(4.3,4.1) 4.3,4.77 4.1,4.97 ; v1(5.5,4.1) R57.2
  Top Layer w0.25: v1(7.6,83.9) C111.1 ; v1(14.7,68.5) 13.95,68.5 C167.1 ; v1(6.6,71.4) 6.6,72.25 ; 30.8,51.2 v1(30.8,50.6) ; 59.85,33.45 60.35,32.95 AUDIO.28 ; 59.85,33.45 58.85,34.45 AUDIO.7 ; 59.85,33.45 AUDIO.12 ; C144.1 42.6,21.35 v1(42.6,22.2) ; 58.52,18.21 58.52,17.62 v1(58.2,17.3) ; U39.4 16.15,89.8 v1(17.5,89.8) ; v1(59,32) 58.35,31.35 AUDIO.17 ; v1(57.3,16.3) 57.52,16.08 RADIO.3 ; v1(17.8,88.2) C153.2 ; 65,23.7 65.4,23.7 65.8,23.3 ; v1(56.8,38) 56.8,37.25 C209.1 ; C154.2 12.6,88.65 v1(12.6,89.1) ; C107.1 24.24,72.66 24.24,72.61 24.35,72.5 v1(24.4,72.5) ; v1(42.6,17.5) 42.6,18.3 LED12.3 ; v1(16.5,87) 15.76,87 15.7,86.94 ; v1(4.5,77.8) C110.1 ; U39.2 13.85,91.6 v1(12.7,91.6) ; C109.1 20.1,85.25 v1(20.1,86) ; AVR.3 33.25,46.65 AVR.25 ; v1(24.9,77.4) C115.1 ; v1(59.4,52.5) 59.4,51.6 LED8.3 ; 65.9,23.3 v1(67.5,21.7) ; v1(24.9,79.9) C112.1 ; v1(20.1,68.4) C108.1 ; v1(4.5,76.8) C114.1
  Top Layer w0.3: C143.1 v1(23.7,23.1) ; v1(21,23.1) 21,24 LED11.3 ; C104.1 v1(12.6,42.3) ; v1(13.4,38.8) 13.4,39.7 LED10.3 ; 56.5,51.64 v1(56.5,52.5) ; v1(55.2,73.3) R55.2
  Top Layer w0.4: C204.2 66.6,33.5 v1(67.2,34.1) ; v1(9.2,8.3) 9.98,8.3 USB.B12A1 v1(10,9.3) ; C203.2 64.64,35.3 v1(65.6,35.3) ; v1(65.9,34.1) 65.6,33.8 C192.1 ; v1(55.4,24) R104.1 ; v1(59.4,26.8) 59.4,27.75 ; v1(17.2,8.3) 17.17,8.27 USB.A12B1 v1(16.4,9.3)
  Top Layer w0.5: v1(5.9,16.6) 5.9,17.5 ; v1(47.5,7.2) 46.3,7.2 ; 11,25.7 11,25.6 ; 11,25.7 v1(11.8,25.7) ; 11,25.7 10.9,25.7 ; 11,25.7 v1(11,26.5) ; v1(30.8,43.1) 30,43.1 ; 58,19.8 v1(58,20.5) 58,21.2 ; v1(49.5,87.8) 50.5,87.8 C132.1 ; v1(41.39,51.41) 41.38,51.4 40.4,51.4 ; v1(21.29,51.71) 21.3,51.7 22,51.7 ; C118.1 35.1,43.15 v1(35.1,42.4) ; 5.7,19.1 5.6,19.1 v1(5,18.5) ; 40.3,49.8 40.9,49.8 v1(41.4,50.3) ; v1(8.6,15.7) 8.6,16.4 ; v1(31.4,39.5) 31.4,38.6 ; v1(3,20) 3,19.3 ; v1(35.4,36.1) 35.4,37.1 ; 9.1,25.7 9.1,25.5 ; 9.1,25.7 v1(9.1,26.5) ; 9.1,25.7 v1(8.4,25.7) ; v1(29.5,53.6) 29,53.1 29,52.8 ; v1(21.49,52.71) 21.5,52.7 22.2,52.7 ; C81.1 v1(29.7,23.4) ; v1(37.8,44.1) 38.8,44.1 ; v1(52,74.3) 52,73.48 Q6.2 52.08,73.5 v1(53.2,73.5) ; v1(35.6,35.1) 36.3,35.1 ; v1(31.1,41.4) 31.1,40.8 ; v1(26.9,49.3) 26.1,49.3 ; v1(35.1,33.5) 35.1,34.2
  vias: v1(-31,48.4) v1(-31,47.3) v1(-30.9,43.7) v1(-30.8,42) v1(-30.6,45.5) v1(-30.05,53.09) v1(-29.9,61.2) v1(-29.3,41.1) v1(-29.1,44.3) v1(-29,76.6) v1(-29,74.6) v1(-29,72.6) v1(-28.7,47) v1(-28.6,48.9) v1(-28.5,42.5) v1(-28.4,59.7) v1(-28.2,44.7) v1(-28.1,38.7) v1(-27.5,73.3) v1(-27.5,60.6) v1(-27.2,47.2) v1(-26.7,43.4) v1(-26.5,61.3) v1(-26.3,48.6) v1(-26,45.3) v1(-25.8,57.5) v1(-25.8,42.2) v1(-25.7,47) v1(-25.5,72.2) v1(-25.5,30.7) v1(-24.7,43.2) v1(-24.1,41.5) v1(-23.9,57.7) v1(-23.9,54.9) v1(-23.9,46.7) v1(-23.9,34.9) v1(-23.9,32.5) v1(-23.7,73.3) v1(-23.7,52.8) v1(-23.5,44.5) v1(-23.3,48.4) v1(-23.2,31.3) v1(-23.1,38.9) v1(-22.7,46.3) v1(-21.7,41.6) v1(-21.7,38) v1(-21.6,36.2) v1(-21.4,76.2) v1(-21.4,70.7) v1(-21.4,68.7) v1(-21.4,66.7) v1(-21.4,64.7) v1(-21.4,62.9) v1(-21.3,46) v1(-21.2,73.3) v1(-21.1,43.7) v1(-21.1,40.3) v1(-20.6,33.4) v1(-20,43) v1(-19.8,82.6) v1(-19.8,46.6) v1(-19.4,64.7) v1(-19.4,62.9) v1(-19.4,35.7) v1(-19.2,44.4) v1(-19,70.7) v1(-18.6,73.3) v1(-18.5,76.3) v1(-17.7,37.6) v1(-17.4,77.1) v1(-17.3,75.3) v1(-17.2,50.3) v1(-17,40.5) v1(-16.7,37.6) v1(-16.6,44.9) v1(-16.5,46.6) v1(-16.4,62.9) v1(-16.2,76) v1(-16.1,73.3) v1(-15.7,56.9) v1(-15.5,59.8) v1(-15.5,44.9) v1(-15.3,42.3) v1(-15.1,50.8) v1(-14.8,76) v1(-14.8,52.4) v1(-14.8,48.3) v1(-14.3,46.5) v1(-13.8,73.3) v1(-13.8,39.4) v1(-13.6,50.1) v1(-13.6,45.2) v1(-13.5,59.8) v1(-13.4,42.8) v1(-13.3,76.3) v1(-12.9,56.2) v1(-12.8,72.3) v1(-12.8,51.2) v1(-12.6,38.8) v1(-12.3,54.4) v1(-12.3,41.9) v1(-12.2,75.7) v1(-12.2,44.3) v1(-11.8,62.9) v1(-11.8,48.7) v1(-11.6,73.7) v1(-11.4,58.7) v1(-11.3,55.8) v1(-11.3,40.6) v1(-11.1,74.9) v1(-11.1,42.6) v1(-11,45.8) v1(-10.9,52.2) v1(-10.9,47.9) v1(-10.6,39.3) v1(-10.3,41.4) v1(-10,38.9) v1(-9.9,42.5) v1(-9.8,51.3) v1(-9.5,49.3) v1(-9.4,93.6) v1(-9.3,46.3) v1(-9.1,86.9) v1(-8.9,44) v1(-8.8,45.2) v1(-8.6,37.4) v1(-8.4,40.3) v1(-8.3,47.7) v1(-8.2,86.8) v1(-8.1,43.1) v1(-8,50.2) v1(-7.6,95.5) v1(-7.6,46) v1(-7,85.1) v1(-6.5,89.5) v1(-6.5,39.2) v1(-5.9,49.9) v1(-5.7,44.5) v1(-4.8,45) v1(-4.3,92.1) v1(1.4,106.6) v1(1.5,101.9) v1(2.7,102.7) v1(3.5,102.4) v1(4.7,108.6) v1(4.7,102.7) v1(5.8,102.6) v1(6.7,102.7) v1(8,105.8) v1(8,72.2) v1(8.7,102.7) v1(10,71.3) v1(10,70.3) v1(10.3,21.1) v1(10.3,19.5) v1(10.3,12.3) v1(10.7,102.7) v1(10.9,108.7) v1(12,19.5) v1(12.1,21.1) v1(12.7,102.7) v1(13.3,79.1) v1(13.3,77.7) v1(13.3,76.3) v1(13.9,108.7) v1(14.6,52.2) v1(14.7,102.7) v1(14.7,79.1) v1(14.7,77.7) v1(14.7,76.3) v1(15,14.1) v1(16,23.6) v1(16.1,79.1) v1(16.1,77.7) v1(16.1,76.3) v1(16.7,102.7) v1(16.7,48.7) v1(18.6,108.7) v1(18.7,102.7) v1(20.7,102.7) v1(20.9,106.6) v1(20.9,104.2) v1(22.6,108.7) v1(24.5,30.2) v1(26.4,27.5) v1(26.7,108.7) v1(26.7,102.3) v1(27.7,5.2) v1(28.2,1.2) v1(29.1,-3.3) v1(29.3,-1.3) v1(29.7,30.6) v1(30.3,5.7) v1(30.6,-5.6) v1(30.8,30.6) v1(31.5,3.5) v1(31.7,-0.2) v1(31.8,7) v1(32,108.7) v1(32.4,6.9) v1(32.7,47.7) v1(32.7,46.1) v1(33.3,7.2) v1(34,0.2) v1(34.1,22.7) v1(34.2,7.9) v1(34.3,47.7) v1(34.3,46.1) v1(34.9,102.1) v1(35,7.6) v1(35,0.5) v1(35.1,5) v1(35.4,108.7) v1(35.7,-1.9) v1(36.3,5.4) v1(36.4,6.8) v1(36.5,6.6) v1(36.6,3.4) v1(36.7,24.4) v1(37.8,29.4) v1(37.9,4.6) v1(38,8) v1(38.9,108.7) v1(38.9,10.2) v1(39.4,102.3) v1(39.5,6.7) v1(39.6,90.9) v1(40.2,9) v1(40.4,11.5) v1(40.5,10.5) v1(41.2,38.7) v1(41.2,37.9) v1(41.4,12.2) v1(41.5,101.9) v1(41.5,8.6) v1(41.7,10.3) v1(41.9,108.7) v1(42.1,7.5) v1(42.4,11.5) v1(42.6,12.5) v1(42.6,5.3) v1(42.9,102.3) v1(43,9.4) v1(43,8.6) v1(43.1,10.5) v1(43.5,41.3) v1(44,5) v1(44.2,102.2) v1(44.9,108.7) v1(44.9,29.6) v1(45.7,101.8) v1(46.2,102.4) v1(47.1,101.9) v1(47.8,108.7) v1(48,101.9) v1(49.2,102.1) v1(49.3,29.5) v1(49.7,108.7) v1(50.7,102.7) v1(50.7,98.7) v1(50.7,94.7) v1(51.7,108.7) v1(51.9,105.2) v1(54.7,102.7) v1(54.7,94.7) v1(54.7,90.7) v1(54.7,86.7) v1(55.5,21.8) v1(55.8,106) v1(56.3,102.4) v1(56.5,24.4) v1(57.3,17.3) v1(57.7,108.7) v1(58.2,16.3) v1(58.7,102.7) v1(58.7,98.7) v1(58.7,94.7) v1(58.7,90.7) v1(58.7,86.7) v1(59,34.4) v1(59.4,24.4) v1(59.9,14.6) v1(60.3,24.1) v1(61,102.6) v1(61.3,103.9) v1(61.3,34.5) v1(61.35,31.95) v1(62,108.7) v1(62.7,102.7) v1(62.7,94.7) v1(62.7,90.7) v1(62.7,86.7) v1(63.7,3.8) v1(64.1,104.9) v1(64.1,102.7) v1(65.1,108.5) v1(65.6,63.8) v1(66.7,102.7) v1(66.7,98.7) v1(66.7,96.7) v1(66.7,94.7) v1(66.7,92.7) v1(66.7,90.7) v1(66.7,88.7) v1(66.7,86.7) v1(66.7,84.7) v1(66.7,82.7) v1(66.7,80.7) v1(66.7,78.7) v1(66.7,76.7) v1(66.7,74.4) v1(66.7,71.7) v1(66.7,68.8) v1(67.2,63.8) v1(67.2,30) v1(68,106.6) v1(68,104) v1(68.1,66.5) v1(68.1,25.1) v1(70.3,41.2) v1(76.8,72.4) v1(77.6,73.8) v1(79.2,72.4) v1(79.7,91.3) v1(79.7,87.6) v1(79.7,83.5) v1(80.7,81) v1(81.2,82.7) v1(81.7,89.2) v1(81.8,72.4) v1(82,84.1) v1(82.1,71) v1(82.7,85.5) v1(83,77) v1(83.1,91.9) v1(83.12,70.95) v1(83.2,81.2) v1(83.2,74.5) v1(83.4,71.6) v1(83.5,88.1) v1(83.7,79.1) v1(84.1,75) v1(84.1,70.1) v1(84.3,83.3) v1(84.4,72.4) v1(84.5,89.2) v1(85.4,86.8) v1(86,84.9) v1(86,79.2) v1(86.2,90.1) v1(86.2,73.8) v1(86.4,78.6) v1(86.4,75.9) v1(86.6,92.4) v1(86.9,81.6) v1(86.9,73) v1(87.1,88.4) v1(87.3,83.2) v1(88,76.9) v1(88.1,78.5) v1(88.2,72.4) v1(88.3,85.9) v1(88.6,74.1) v1(88.7,84) v1(89.2,92.5) v1(89.3,79.7) v1(89.3,70.8) v1(89.4,88.7) v1(89.8,82.3) v1(89.9,75.9) v1(90.7,79) v1(90.8,72.4) v1(91.1,84.4) v1(91.3,87) v1(91.8,90.4) v1(91.8,76.6) v1(92,73.3) v1(92.1,81.5) v1(93.7,71.6) v1(95.5,72.4)
VBATT: length 4
  Bottom Layer w0.15: v1(17.5,15.2) R126.2
  Bottom Layer w0.5: v1(17.5,15.2) v1(17.5,13.2)
VCC: length 10.7
  Top Layer w0.15: 27.2,31.2 27.2,30.1
  Top Layer w0.5: C81.2 31.3,22.7 5V.5 v1(33.3,22.7)
  Top Layer w0.7: C220.2 C219.2 6.95,24.1 L17.2 6.6,26.67 AAA_PWR.2
  vias: v1(12,24.3) v1(12,23.5) v1(12.8,24.3) v1(12.8,23.5) v1(13.6,24.3) v1(13.6,23.5) v1(23.9,31.7) v1(23.9,31) v1(24.6,31.7) v1(24.6,31) v1(33.9,38.6) v1(33.9,37.9) v1(34.6,38.6) v1(34.6,37.9)
VDD_EN: length 28.1
  Top Layer w0.15: v1(31.1,49.2) 28.1,49.2 v1(26.9,50.4) 26.34,50.96 U40.1 ; U40.5 25.7,53.2 26.2,53.7 v1(26.5,53.7) ; v1(36.5,37.3) 36.5,37.1 36.7,36.9 37.2,36.9 ; v1(35.3,44) 34.4,44 34.25,44.15 AVR.5
  Bottom Layer w0.15: v1(26.5,53.7) 26.5,50.8 v1(26.9,50.4) ; v1(36.5,37.3) 36.5,41.8 35.3,43 v1(35.3,44) 35.3,45.9 32,49.2 v1(31.1,49.2)
ACCEL_INT: length 9.4
  Top Layer w0.15: v1(29.3,40.4) 29.05,40.15 U26.9 ; AVR.22 30.55,46.65 30.4,46.8 v1(30.1,46.8)
  Bottom Layer w0.15: v1(29.3,40.4) 29.3,43.5 30.1,44.3 v1(30.1,46.8)
AUDIO_INT: length 67.5
  Top Layer w0.15: RP2350B.2 20,74.3 20.5,73.8 20.5,73.5 23.6,70.4 23.6,68 30.5,61.1 30.5,57.3 32,55.8 34.8,55.8 35.2,55.4 48.2,55.4 51.4,52.2 51.4,40.7 53.4,38.7 53.4,35 54.45,33.95 AUDIO.11
AUDIO_MICBIAS: length 7.1
  Top Layer w0.15: AUDIO.19 59.35,29.95 v1(59.6,29.7) ; R123.2 v1(55.4,29.6) R103.2
  Bottom Layer w0.15: v1(59.6,29.7) 55.5,29.7 v1(55.4,29.6)
AUDIO_RESET: length 74.8
  Top Layer w0.15: RP2350B.8 21.3,76.7 21.9,76.1 24,76.1 26.6,73.5 26.6,69.45 33.65,62.4 34.3,62.4 36.11,60.59 36.11,58.99 36.7,58.4 49.8,58.4 54.4,53.8 54.4,42.2 55,41.6 61,41.6 63.3,39.3 63.3,34.7 63.05,34.45 AUDIO.31
AVR_INT: length 33.7
  Top Layer w0.15: RP2350B.80 19.41,72.79 v1(22.3,69.9) ; v1(26.9,47.9) 28.6,47.9 28.7,48 30.5,48 30.85,47.65 AVR.20
  Bottom Layer w0.15: v1(22.3,69.9) 23.2,69 23.2,55.85 24.1,54.95 24.1,50.7 v1(26.9,47.9)
AVR_TX: length 36.5
  Top Layer w0.15: v1(13.3,55.8) 14.8,55.8 24.95,45.65 AVR.24
  Bottom Layer w0.15: DEBUG.1 8.52,55.8 v1(13.3,55.8)
BTN_1: length 45
  Top Layer w0.15: 35.52,48.15 40.55,48.15 v1(41,48.6) 42.3,49.9 43.73,49.9 D9.2 D17.2
  Top Layer w0.2: D5.2 35.5,17.4 v1(36.4,18.3)
  Bottom Layer w0.15: 41.1,48.7 38.4,46 38.4,20.3 v1(36.4,18.3)
BTN_2: length 46.4
  Top Layer w0.15: D10.2 D14.2 43.78,46.65 35.52,46.65
  Top Layer w0.2: D6.2 33.8,17.5 34,17.7 v1(34.7,17.7)
  Bottom Layer w0.15: v1(34.7,17.7) 38.1,17.7 39.6,19.2 39.6,44.2 42.1,46.7 v1(42.8,46.7)
BTN_3: length 48.2
  Top Layer w0.15: 35.52,47.15 41.65,47.15 v1(42.4,47.9) 42.8,48.3 D15.2 ; D7.2 32.1,16.6 33,15.7 36.3,15.7 37.2,16.6 D11.2
  Top Layer w0.2: 37.2,16.93 38.5,18.23 v1(38.5,19.2)
  Bottom Layer w0.15: v1(38.5,19.2) 39,19.7 39,44.5 v1(42.4,47.9)
BTN_4: length 38.8
  Top Layer w0.15: v1(37.4,42.8) 35.33,44.87 AVR.6
  Top Layer w0.2: D12.2 28.7,17.6 29,17.9 v1(29.5,17.9) 30.1,17.9 30.4,17.6 D8.2
  Bottom Layer w0.15: v1(29.5,17.9) 30.2,18.6 35.8,18.6 37.8,20.6 37.8,42.4 v1(37.4,42.8)
BTN_ABXY: length 102.7
  Top Layer w0.15: 35.52,46.15 42.45,46.15 v1(42.8,45.8) ; v1(41,32.2) A1.2 A1.4 ; B3.4 24.7,16.65 26.25,15.1 37.2,15.1 v1(39.5,17.4) 40.2,16.7 B2.2 44.6,16.8 ; B1.4 B1.2 v1(55.7,44.3)
  Top Layer w0.2: B2.4 B2.2 ; B3.4 B3.2
  Bottom Layer w0.15: v1(55.7,44.3) 54.2,45.8 v1(42.8,45.8) 42.1,45.8 40.2,43.9 40.2,33 v1(41,32.2) 40.2,31.4 40.2,18.1 v1(39.5,17.4)
BTN_CTRL: length 62.1
  Top Layer w0.15: v1(45,49.1) 42.7,49.1 41.25,47.65 35.52,47.65 ; v1(66.5,55.9) 64.2,53.6 v1(64.2,41.7) v1(64.2,37.6)
  Bottom Layer w0.15: VOL_DOWN.2 66.5,35.3 v1(64.2,37.6) ; v1(45,49.1) 54.4,49.1 56.4,47.1 58.8,47.1 v1(64.2,41.7) VOL_UP.2
  Bottom Layer w0.2: v1(66.5,55.9) HOME1.1
BTN_DPAD: length 44.7
  Top Layer w0.15: AVR.19 31.15,48.15 30.7,48.6 26.5,48.6 v1(25.9,48) ; LEFT1.2 LEFT1.4
  Top Layer w0.2: LEFT1.4 17.2,45.15 19.15,43.2 BOTTOM1.2 BOTTOM1.4 19.15,37.2 17.2,35.25 RIGHT1.2 ; RIGHT1.4 11.2,35.25 9.25,37.2 TOP1.2 TOP1.4 9.25,43.2 11.2,45.15 LEFT1.2
  Bottom Layer w0.15: v1(25.9,48) 22.1,44.2 v1(18.2,44.2)
DB_0: length 60.7
  Top Layer w0.15: RP2350B.44 6.77,80.3 5.8,81.27 5.8,84.8 7.7,86.7 7.7,93.3 10.1,95.7 20.1,95.7 22,93.8 31,93.8 43.3,81.5 44.27,81.5 DISPLAY.24
DB_1: length 59.3
  Top Layer w0.15: DISPLAY.23 43.05,80.95 30.8,93.2 21.8,93.2 19.7,95.3 10.5,95.3 8.3,93.1 8.3,86.5 6.2,84.4 6.2,81.43 6.93,80.7 RP2350B.43
DB_2: length 57.9
  Top Layer w0.15: DISPLAY.22 42.75,80.45 30.6,92.6 21.6,92.6 19.3,94.9 10.9,94.9 8.9,92.9 8.9,86.3 6.6,84 6.6,81.6 7.1,81.1 RP2350B.42
DB_3: length 52.3
  Top Layer w0.15: RP2350B.40 10.9,83.1 9.5,84.5 9.5,92.7 11.3,94.5 18.9,94.5 21.4,92 30.4,92 42.45,79.95 DISPLAY.21
DB_4: length 51.3
  Top Layer w0.15: DISPLAY.20 42.15,79.45 30.2,91.4 21.2,91.4 18.5,94.1 11.7,94.1 10.1,92.5 10.1,84.47 11.3,83.27 RP2350B.39
DB_5: length 50.4
  Top Layer w0.15: RP2350B.38 11.7,83.43 10.7,84.43 10.7,92.3 12.1,93.7 18.1,93.7 21,90.8 30,90.8 41.85,78.95 DISPLAY.19
DB_6: length 49.5
  Top Layer w0.15: RP2350B.37 12.1,83.6 11.3,84.4 11.3,92.1 12.5,93.3 17.7,93.3 20.8,90.2 29.8,90.2 41.55,78.45 DISPLAY.18
DB_7: length 48.6
  Top Layer w0.15: DISPLAY.17 41.25,77.95 29.7,89.5 20.7,89.5 17.3,92.9 12.9,92.9 11.9,91.9 11.9,84.36 12.5,83.76 RP2350B.36
DB_8: length 37.3
  Top Layer w0.15: RP2350B.28 15.7,84.4 16.8,85.5 16.8,86.1 19.5,88.8 29.6,88.8 40.95,77.45 DISPLAY.16
DB_9: length 36.5
  Top Layer w0.15: RP2350B.27 16.1,84.2 17.2,85.3 17.2,85.9 19.5,88.2 29.4,88.2 40.65,76.95 DISPLAY.15
DB_10: length 35.7
  Top Layer w0.15: RP2350B.26 16.5,84 17.6,85.1 17.6,85.73 19.47,87.6 29.2,87.6 40.35,76.45 DISPLAY.14
DB_11: length 34.9
  Top Layer w0.15: DISPLAY.13 40.05,75.95 29,87 19.43,87 18,85.57 18,84.9 16.9,83.8 RP2350B.25
DB_12: length 33.2
  Top Layer w0.15: RP2350B.23 17.7,83.4 18.6,84.3 20.92,84.3 23.02,86.4 28.8,86.4 39.75,75.45 DISPLAY.12
DB_13: length 32.4
  Top Layer w0.15: DISPLAY.11 39.45,74.95 28.6,85.8 22.99,85.8 21.09,83.9 18.8,83.9 18.1,83.2 RP2350B.22
DB_14: length 31.6
  Top Layer w0.15: RP2350B.21 18.5,83 19,83.5 21.25,83.5 22.95,85.2 28.4,85.2 39.15,74.45 DISPLAY.10
DB_15: length 30.3
  Top Layer w0.15: RP2350B.20 20.1,81.5 23.1,84.5 28.3,84.5 38.85,73.95 DISPLAY.9
DISP_CSX: length 65.7
  Top Layer w0.15: RP2350B.48 5.87,78.7 4.2,80.37 4.2,86.4 5.3,87.5 5.3,94.1 8.5,97.3 21.7,97.3 22.8,96.2 31.8,96.2 42.55,85.45 DISPLAY.32
DISP_DCX: length 64.3
  Top Layer w0.15: DISPLAY.31 42.25,84.95 31.6,95.6 22.6,95.6 21.3,96.9 8.9,96.9 5.9,93.9 5.9,87.3 4.6,86 4.6,80.53 6.03,79.1 RP2350B.47
DISP_LED_K: length 8.3
  Top Layer w0.3: DISPLAY.6 46.92,72.45 ; 46.92,72.45 R84.1 46.52,72.95 DISPLAY.7 ; 46.92,72.45 46.42,71.95 DISPLAY.5
DISP_RDX: length 61.4
  Top Layer w0.15: DISPLAY.29 41.65,83.95 31.2,94.4 22.2,94.4 20.5,96.1 9.7,96.1 7.1,93.5 7.1,86.9 5.4,85.2 5.4,81 6.5,79.9 RP2350B.45
DISP_TE: length 67.2
  Top Layer w0.15: DISPLAY.33 42.85,85.95 32,96.8 23,96.8 22.1,97.7 8.1,97.7 4.7,94.3 4.7,87.7 3.8,86.8 3.8,80.2 5.7,78.3 RP2350B.49
DISP_WRX: length 62.9
  Top Layer w0.15: DISPLAY.30 41.95,84.45 31.4,95 22.4,95 20.9,96.5 9.3,96.5 6.5,93.7 6.5,87.1 5,85.6 5,80.7 6.2,79.5 RP2350B.46
EMBEDDED_ANTENNA: length 22.4
  Top Layer w0.25: v1(57.9,14.5) 58.02,14.62 RADIO.4 ; v1(47.5,6.2) 46.43,5.13 L19.1 46.2,2.58 FMA.1
  Bottom Layer w0.25: v1(57.9,14.5) 51.5,14.5 49.6,12.6 49.6,7 48.8,6.2 v1(47.5,6.2)
GPIO_11: length 53.8
  Top Layer w0.15: RP2350B.9 21.5,77.1 21.8,76.8 25.7,76.8 25.9,76.6 arc(25.99,76.39) 25.9,76.18 25.57,75.85 arc(25.57,75.43) 26,75.43 26.32,75.75 arc(26.75,75.75) 26.75,75.33 26.42,75 arc(26.42,74.58) 26.85,74.58 27.17,74.9 arc(27.6,74.9) 27.6,74.48 27.27,74.15 arc(27.27,73.73) 27.7,73.73 28.02,74.05 arc(28.23,74.14) 28.45,74.05 28.6,73.9 28.6,73.5 arc(28.51,73.29) 28.3,73.2 27.5,73.2 arc(27.2,72.9) 27.5,72.6 28.4,72.6 arc(28.7,72.3) 28.4,72 27.5,72 arc(27.2,71.7) 27.5,71.4 28.4,71.4 arc(28.7,71.1) 28.4,70.8 27.5,70.8 arc(27.2,70.5) 27.5,70.2 28.4,70.2 arc(28.7,69.9) 28.4,69.6 28.1,69.6 arc(27.8,69.3) 28.1,69 28.3,69 arc(28.51,68.91) 28.6,68.7 28.6,68.4 34,63 34.85,63 arc(35.06,62.91) 35.15,62.7 35.15,62.5 arc(35.45,62.2) 35.75,62.5 35.75,62.7 arc(35.84,62.91) 36.05,63 36.38,63 36.65,62.74 arc(36.73,62.52) 36.65,62.31 36.18,61.85 arc(36.18,61.42) 36.6,61.42 37.87,62.69 arc(38.29,62.69) 38.29,62.26 37.38,61.35 arc(37.38,60.92) 37.8,60.92 38.82,61.94 arc(39.24,61.94) 39.24,61.52 38.23,60.5 arc(38.23,60.07) 38.65,60.07 38.77,60.19 arc(38.98,60.28) 39.19,60.19 CARTRIDGE.9
GPIO_12: length 53.8
  Top Layer w0.15: CARTRIDGE.8 41.71,60.21 arc(41.62,60.42) 41.71,60.64 42.13,61.05 arc(42.13,61.47) 41.7,61.47 40.94,60.71 arc(40.51,60.71) 40.51,61.13 41.28,61.9 arc(41.28,62.32) 40.85,62.32 40.44,61.91 arc(40.01,61.91) 40.01,62.33 40.43,62.75 arc(40.43,63.17) 40,63.17 39.59,62.76 arc(39.38,62.67) 39.17,62.76 38.42,63.5 34.4,63.5 30.5,67.4 30.5,67.7 arc(30.41,67.91) 30.2,68 29.9,68 arc(29.6,68.3) 29.9,68.6 30.2,68.6 arc(30.5,68.9) 30.2,69.2 29.7,69.2 arc(29.4,69.5) 29.7,69.8 30.2,69.8 arc(30.5,70.1) 30.2,70.4 29.6,70.4 arc(29.3,70.7) 29.6,71 30.2,71 arc(30.5,71.3) 30.2,71.6 29.6,71.6 arc(29.3,71.9) 29.6,72.2 30.2,72.2 arc(30.5,72.5) 30.2,72.8 29.6,72.8 arc(29.3,73.1) 29.6,73.4 30.2,73.4 arc(30.41,73.49) 30.5,73.7 30.5,74.3 29.75,75.05 arc(29.53,75.14) 29.32,75.05 29.05,74.78 arc(28.62,74.78) 28.62,75.2 28.9,75.48 arc(28.9,75.9) 28.47,75.9 28.2,75.63 arc(27.77,75.63) 27.77,76.05 28.05,76.33 arc(28.05,76.75) 27.62,76.75 27.35,76.48 arc(26.92,76.48) 26.92,76.9 27.2,77.18 arc(27.29,77.39) 27.2,77.6 26.9,77.9 RP2350B.11
GPIO_13: length 53.8
  Top Layer w0.15: CARTRIDGE.7 44.23,60.23 arc(44.14,60.44) 44.23,60.66 44.58,61 arc(44.58,61.42) 44.15,61.42 43.46,60.73 arc(43.03,60.73) 43.03,61.15 43.73,61.85 arc(43.73,62.27) 43.3,62.27 42.96,61.93 arc(42.53,61.93) 42.53,62.35 42.88,62.7 arc(42.88,63.12) 42.45,63.12 42.11,62.78 arc(41.69,62.78) 41.69,63.2 42.03,63.55 arc(42.03,63.97) 41.61,63.97 41.26,63.63 arc(41.05,63.54) 40.84,63.63 40.46,64 34.8,64 32.4,66.4 32.4,66.9 arc(32.31,67.11) 32.1,67.2 31.7,67.2 arc(31.4,67.5) 31.7,67.8 32.1,67.8 arc(32.4,68.1) 32.1,68.4 31.5,68.4 arc(31.2,68.7) 31.5,69 32.1,69 arc(32.4,69.3) 32.1,69.6 31.5,69.6 arc(31.2,69.9) 31.5,70.2 32.1,70.2 arc(32.4,70.5) 32.1,70.8 31.5,70.8 arc(31.2,71.1) 31.5,71.4 32.1,71.4 arc(32.4,71.7) 32.1,72 31.5,72 arc(31.2,72.3) 31.5,72.6 32.1,72.6 arc(32.31,72.69) 32.4,72.9 32.4,73.3 27.1,78.6 26.5,78.6 26.2,78.3 RP2350B.12
GPIO_14: length 53.8
  Top Layer w0.15: CARTRIDGE.6 46.8,60.2 arc(46.71,60.41) 46.8,60.63 47.18,61 arc(47.18,61.42) 46.75,61.42 46.18,60.85 arc(45.75,60.85) 45.75,61.27 46.33,61.85 arc(46.33,62.27) 45.9,62.27 45.53,61.9 arc(45.1,61.9) 45.1,62.32 45.48,62.7 arc(45.48,63.12) 45.05,63.12 44.68,62.75 arc(44.26,62.75) 44.26,63.17 44.63,63.55 arc(44.63,63.97) 44.21,63.97 43.83,63.6 arc(43.41,63.6) 43.41,64.02 43.43,64.04 arc(43.43,64.47) 43.01,64.47 42.98,64.44 arc(42.77,64.36) 42.56,64.44 42.5,64.5 35.2,64.5 33.9,65.8 33.9,66.4 arc(33.81,66.61) 33.6,66.7 33.4,66.7 arc(33.1,67) 33.4,67.3 33.6,67.3 arc(33.9,67.6) 33.6,67.9 33.4,67.9 arc(33.1,68.2) 33.4,68.5 33.6,68.5 arc(33.9,68.8) 33.6,69.1 33.4,69.1 arc(33.1,69.4) 33.4,69.7 33.6,69.7 arc(33.9,70) 33.6,70.3 33.4,70.3 arc(33.1,70.6) 33.4,70.9 33.6,70.9 arc(33.9,71.2) 33.6,71.5 33.4,71.5 arc(33.1,71.8) 33.4,72.1 33.6,72.1 arc(33.81,72.19) 33.9,72.4 33.9,72.7 27.3,79.3 26.3,79.3 25.7,78.7 RP2350B.13
GPIO_15: length 53.8
  Top Layer w0.15: RP2350B.14 25.2,79.1 26.1,80 27.5,80 34.9,72.6 34.9,72.4 arc(34.86,72.29) 34.75,72.25 arc(34.64,72.2) 34.6,72.1 34.6,71.8 arc(34.64,71.69) 34.75,71.65 arc(34.86,71.6) 34.9,71.5 34.9,71.2 arc(34.86,71.09) 34.75,71.05 arc(34.64,71) 34.6,70.9 34.6,70.6 arc(34.64,70.49) 34.75,70.45 arc(34.86,70.4) 34.9,70.3 34.9,70 arc(34.86,69.89) 34.75,69.85 arc(34.64,69.8) 34.6,69.7 34.6,69.4 arc(34.64,69.29) 34.75,69.25 arc(34.86,69.2) 34.9,69.1 34.9,68.8 arc(34.86,68.69) 34.75,68.65 arc(34.64,68.6) 34.6,68.5 34.6,68.2 arc(34.64,68.09) 34.75,68.05 arc(34.86,68) 34.9,67.9 34.9,67.6 arc(34.86,67.49) 34.75,67.45 arc(34.64,67.4) 34.6,67.3 34.6,67 arc(34.64,66.89) 34.75,66.85 arc(34.86,66.8) 34.9,66.7 34.9,65.9 35.8,65 44.54,65 45.08,64.46 arc(45.29,64.38) 45.5,64.46 45.91,64.87 arc(46.33,64.87) 46.33,64.44 45.93,64.04 arc(45.93,63.62) 46.35,63.62 46.76,64.02 arc(47.18,64.02) 47.18,63.6 46.78,63.19 arc(46.78,62.77) 47.2,62.77 47.6,63.17 arc(48.03,63.17) 48.03,62.75 47.62,62.34 arc(47.62,61.92) 48.05,61.92 48.45,62.32 arc(48.88,62.32) 48.88,61.9 48.47,61.49 arc(48.47,61.07) 48.9,61.07 49.3,61.47 arc(49.73,61.47) 49.73,61.05 49.32,60.65 arc(49.23,60.43) 49.32,60.22 CARTRIDGE.5
GPIO_16: length 53.9
  Top Layer w0.15: RP2350B.16 21.5,79.9 22.3,80.7 27.7,80.7 35.6,72.8 35.6,67.5 37.6,65.5 46.58,65.5 46.7,65.38 arc(46.91,65.29) 47.12,65.38 arc(47.55,65.38) 47.55,64.96 arc(47.55,64.53) 47.97,64.53 48.31,64.87 arc(48.73,64.87) 48.73,64.44 48.4,64.11 arc(48.4,63.69) 48.82,63.69 49.16,64.02 arc(49.58,64.02) 49.58,63.6 49.25,63.26 arc(49.25,62.84) 49.67,62.84 50,63.17 arc(50.43,63.17) 50.43,62.75 50.09,62.41 arc(50.09,61.99) 50.52,61.99 50.85,62.32 arc(51.28,62.32) 51.28,61.9 50.94,61.56 arc(50.94,61.14) 51.37,61.14 51.75,61.52 arc(52.18,61.52) 52.18,61.1 51.79,60.72 arc(51.7,60.5) 51.79,60.29 CARTRIDGE.4
GPIO_17: length 53.6
  Top Layer w0.15: CARTRIDGE.3 54.31,60.31 arc(54.22,60.52) 54.31,60.74 54.48,60.9 arc(54.48,61.32) 54.05,61.32 53.89,61.16 arc(53.46,61.16) 53.46,61.58 53.63,61.75 arc(53.63,62.17) 53.2,62.17 53.04,62.01 arc(52.61,62.01) 52.61,62.43 52.78,62.6 arc(52.78,63.02) 52.35,63.02 52.19,62.86 arc(51.77,62.86) 51.77,63.28 51.93,63.45 arc(51.93,63.87) 51.51,63.87 51.34,63.71 arc(50.92,63.71) 50.92,64.13 51.08,64.29 arc(51.08,64.72) 50.66,64.72 50.49,64.55 arc(50.28,64.47) 50.07,64.55 48.62,66 38,66 36.3,67.7 36.3,73 27.9,81.4 22.3,81.4 21.2,80.3 RP2350B.17
GPIO_18: length 53.7
  Top Layer w0.15: RP2350B.18 20.9,80.7 22.3,82.1 28.1,82.1 37,73.2 37,67.9 38.4,66.5 50.66,66.5 54.86,62.3 arc(55.08,62.21) 55.29,62.3 55.53,62.54 arc(55.96,62.54) 55.96,62.12 55.71,61.87 arc(55.71,61.45) 56.14,61.45 56.43,61.74 arc(56.86,61.74) 56.86,61.32 56.56,61.02 arc(56.47,60.81) 56.56,60.6 CARTRIDGE.2
GPIO_19: length 53.8
  Top Layer w0.15: CARTRIDGE.1 59.8,59.7 52.5,67 38.8,67 37.7,68.1 37.7,73.4 28.3,82.8 22.3,82.8 20.6,81.1 RP2350B.19
GPIO_47: length 16.2
  Top Layer w0.15: RP2350B.58 9.3,74.7 8.44,73.84 v1(8.44,73.8)
  Bottom Layer w0.15: v1(8.44,73.8) 8.44,63.86 9.2,63.1 CARTRIDGE.21
HEADSET_ANTENNA: length 8.7
  Top Layer w0.25: C242.2 60.7,12.7 59.8,13.6 57.5,13.6 57.02,14.08 RADIO.2
HEADSET_DETECT: length 47.8
  Top Layer w0.15: v1(56.9,35.6) 58.32,35.6 AUDIO.8 ; 55.4,31.33 55.4,31.8 v1(55.8,32.2) ; 61.2,27.75 61.2,27.4 v1(60.4,26.6) ; v1(53.7,21.4) 52,19.7 52,16.3 v1(50.1,14.4)
  Top Layer w0.2: 50.11,3.4 48.7,4.8 v1(48.7,7.9)
  Bottom Layer w0.15: v1(53.7,21.4) 53.7,23.8 55.2,25.3 59.04,25.3 60.34,26.6 v1(60.4,26.6) 60.4,30.3 59.9,30.8 57.2,30.8 v1(55.8,32.2) 55.8,34.5 v1(56.9,35.6)
  Bottom Layer w0.2: v1(48.7,7.9) 48.7,13 v1(50.1,14.4)
HEADSET_LEFT: length 33.3
  Top Layer w0.25: v1(63.2,30.9) 62.65,31.45 AUDIO.25 ; v1(49.4,15.2) 48.2,15.2 47.2,14.2 C199.2
  Bottom Layer w0.25: v1(49.4,15.2) 61.2,15.2 62.7,16.7 62.7,29.4 63.2,29.9 v1(63.2,30.9)
HEADSET_MIC: length 2
  Top Layer w0.15: AUDIO.21 60.35,30.05 61.2,29.2 61.2,29.14
HEADSET_RIGHT: length 27.8
  Top Layer w0.25: v1(63.4,32.4) 63.35,32.45 AUDIO.27 ; C200.2 64.8,6.21 v1(64.8,8.1)
  Bottom Layer w0.25: v1(64.8,8.1) 63.74,9.16 63.74,28.83 63.9,28.99 63.9,31.9 v1(63.4,32.4)
I2C_SCL: length 59.2
  Top Layer w0.15: v1(27.5,45) v1(28.7,45) 28.7,44.13 R45.1 ; U26.13 27.62,37.94 v1(26.67,37.94) ; v1(27.1,51.4) 26.85,51.65 U40.2 ; v1(31.7,51.2) 32.33,51.2 U41.4 32.65,51.25 33.25,50.65 33.25,48.92 ; v1(12.2,17) 11.95,17.25 PWR.5
  Bottom Layer w0.15: v1(27.1,51.4) 27.5,51 v1(27.5,45) 27.5,40.3 26.7,39.5 26.7,37.97 ; v1(28.7,45) 28.7,49.5 30.4,51.2 v1(31.7,51.2) ; 26.7,37.97 26.7,30.8 18.3,22.4 18.3,21.2 TP7.1 17.18,20.18 14,17 v1(12.2,17) ; 26.7,37.97 v1(26.67,37.94)
I2C_SCL_VDD: length 106.2
  Top Layer w0.15: v1(54.4,35.2) v1(55.3,36.1) 56.45,34.95 AUDIO.9 ; v1(60.9,15.9) 60.74,16.06 RADIO.7 ; RP2350B.78 17.7,71.9 18.1,71.5 18.8,71.5 21.5,68.8 21.5,67.5 25.8,63.2 25.8,57.1 v1(26.7,56.2) 27.8,55.1 30,55.1 31.1,54 33.9,54 34.3,53.6 47.3,53.6 49.6,51.3 49.6,39.8 v1(50.3,39.1) ; 25.7,50.2 U40.10
  Bottom Layer w0.15: v1(55.3,36.1) 53.9,37.5 51.9,37.5 v1(50.3,39.1) ; v1(54.4,35.2) 51,31.8 51,19.4 54.6,15.8 60.8,15.8 v1(60.9,15.9) ; v1(26.7,56.2) 25.8,55.3 25.8,50.3 v1(25.7,50.2)
I2C_SDA: length 59.3
  Top Layer w0.15: v1(31.7,52.5) 32.33,52.5 U41.6 32.95,52.55 33.75,51.75 33.75,48.92 ; v1(27.1,53.1) 27,53.1 26.55,52.65 U40.4 ; R46.1 28.73,42.33 28.4,42 v1(28.1,42) ; PWR.6 12.45,17.95 13.1,17.3 v1(13.1,16.4) ; v1(27.4,36.6) 27.4,37.3 27.5,37.4 U26.14
  Bottom Layer w0.15: 28.1,52.1 v1(28.1,42) 28.1,40 27.4,39.3 v1(27.4,36.6) 27.4,30.6 19.5,22.7 19.5,20.1 17.9,18.5 16.4,18.5 14.3,16.4 v1(13.1,16.4) ; 28.1,52.1 v1(27.1,53.1) ; 28.1,52.1 28.5,52.5 v1(31.7,52.5)
I2C_SDA_VDD: length 101.1
  Top Layer w0.15: v1(60.9,16.8) 60.66,16.56 RADIO.8 ; 25.8,54.4 25.1,55.1 25.1,56.8 25.5,57.2 25.5,62.9 21,67.4 21,68.7 18.7,71 17.9,71 17.3,71.6 RP2350B.77 ; 25.8,54.4 25.06,53.66 U40.6 25.1,52.69 ; 25.8,54.4 29.8,54.4 30.8,53.4 33.6,53.4 34,53 47,53 49,51 49,39.5 v1(49.6,38.9) ; v1(55.3,35.2) 56.05,34.45 AUDIO.10
  Bottom Layer w0.15: v1(60.9,16.8) 54.5,16.8 51.6,19.7 51.6,31.5 v1(55.3,35.2) 53.6,36.9 51.6,36.9 v1(49.6,38.9)
I2S_BCK: length 70.3
  Top Layer w0.15: AUDIO.2 61.35,38.25 58.6,41 54.7,41 53.8,41.9 53.8,53.5 49.5,57.8 36.4,57.8 35.6,58.6 35.6,60.2 34,61.8 33.4,61.8 26,69.2 26,73.4 23.9,75.5 21.9,75.5 21.1,76.3 RP2350B.7
I2S_DIN: length 67.3
  Top Layer w0.15: AUDIO.4 60.35,37.45 58,39.8 54.1,39.8 52.6,41.3 52.6,52.8 48.8,56.6 35.8,56.6 35.4,57 34.5,57 33.1,58.4 33.1,60.3 24.8,68.6 24.8,70.8 20.5,75.1 RP2350B.4
I2S_DOUT: length 67.7
  Top Layer w0.15: AUDIO.5 59.85,37.05 57.7,39.2 53.8,39.2 52,41 52,52.5 48.5,56 35.5,56 35.1,56.4 32.3,56.4 31,57.7 31,61.5 24.2,68.3 24.2,70.6 21,73.8 21,74.1 20.4,74.7 RP2350B.3
I2S_LRCK: length 69.7
  Top Layer w0.15: RP2350B.6 20.9,75.9 21.9,74.9 23.8,74.9 25.4,73.3 25.4,68.9 33.6,60.7 33.6,58.8 34.8,57.6 35.7,57.6 36.1,57.2 49.2,57.2 53.2,53.2 53.2,41.6 54.4,40.4 58.3,40.4 60.85,37.85 AUDIO.3
IOVDD: length 80.4
  Top Layer w0.15: R76.1 v1(49.5,86.3) ; 39.4,35.1 v1(41,35.1) ; 39.3,35.1 39.3,34 39.4,33.9
  Top Layer w0.2: 15.7,85.85 15.7,85.1 15.3,84.7 RP2350B.29 15.3,81 ; C112.2 22.3,79.9 21.9,79.5 RP2350B.15 18.3,79.5 ; 13.9,70.4 14.1,70.6 RP2350B.69 14.1,74.1 ; 13.9,70.4 13.7,70.6 RP2350B.68 13.7,74.1 ; 13.9,70.4 C167.2 ; 10.7,81.5 RP2350B.41 7.95,81.5 C111.2 ; C116.2 6.64,73.3 8.8,73.3 9.4,73.9 RP2350B.60 10.8,73.9 ; C108.2 18.1,70.4 17.8,70.4 16.9,71.3 RP2350B.76 16.9,74 ; C110.2 6.64,77.9 RP2350B.50 10.8,77.9 ; 8.07,70.3 8,70.23 v1(8,69.4) ; 22.91,73.99 22.6,74.3 21.9,74.3 20.7,75.5 RP2350B.5 18.2,75.5 ; 17.3,81.1 RP2350B.24 17.3,83.6 18.86,85.15 18.86,85.2
  Top Layer w0.25: 65.4,22.8 65.9,22.3 65.9,21.8 v1(66.7,21) ; 59.22,21.1 v1(59.22,20.52) 59.22,19.88 59.2,19.85 ; 59.22,21.1 59.22,21.12 C237.1 59.14,21.1 ; 59.22,21.1 59.7,21.1 60.1,20.7 60.1,18 59.66,17.56 RADIO.10 ; 59.22,21.1 59.14,21.1 ; C192.2 C204.1 ; C192.2 C191.2 64.55,31.8 63.2,31.8 63.05,31.95 AUDIO.26 ; C192.2 v1(65.6,30.9) ; v1(57.9,38) 57.9,37.24 C209.2 58.6,37.2 59.35,36.45 AUDIO.6 ; 59.2,19.85 59.2,19.84 59.2,19 59.02,18.82 RADIO.11 ; 59.2,19.85 C236.2 59.14,19.9 59.2,19.85 ; 58.95,21.1 59.14,21.1 ; AUDIO.30 63.45,33.95 v1(63.7,34.2)
  Top Layer w0.4: C132.2 51.8,89.3 52.2,89.7 microSD.4
  Top Layer w0.5: 35,28.1 35,30.6 36.4,30.6 36.8,31 v1(36.8,31.5) v1(36.8,32.2) ; C132.2 v1(49.5,89.3)
  vias: v1(18.5,81.4) v1(18.5,80.8) v1(18.5,80.2) v1(18.5,74.5) v1(18.5,73.9) v1(24.5,56.4) v1(41.2,41.1) v1(41.2,40.4) v1(41.2,39.7) v1(41.9,41.1) v1(41.9,40.4) v1(41.9,39.7)
